# EAGLE design MSSRP-Temperature_System_beta_2layer (EAGLE 6.6.0)
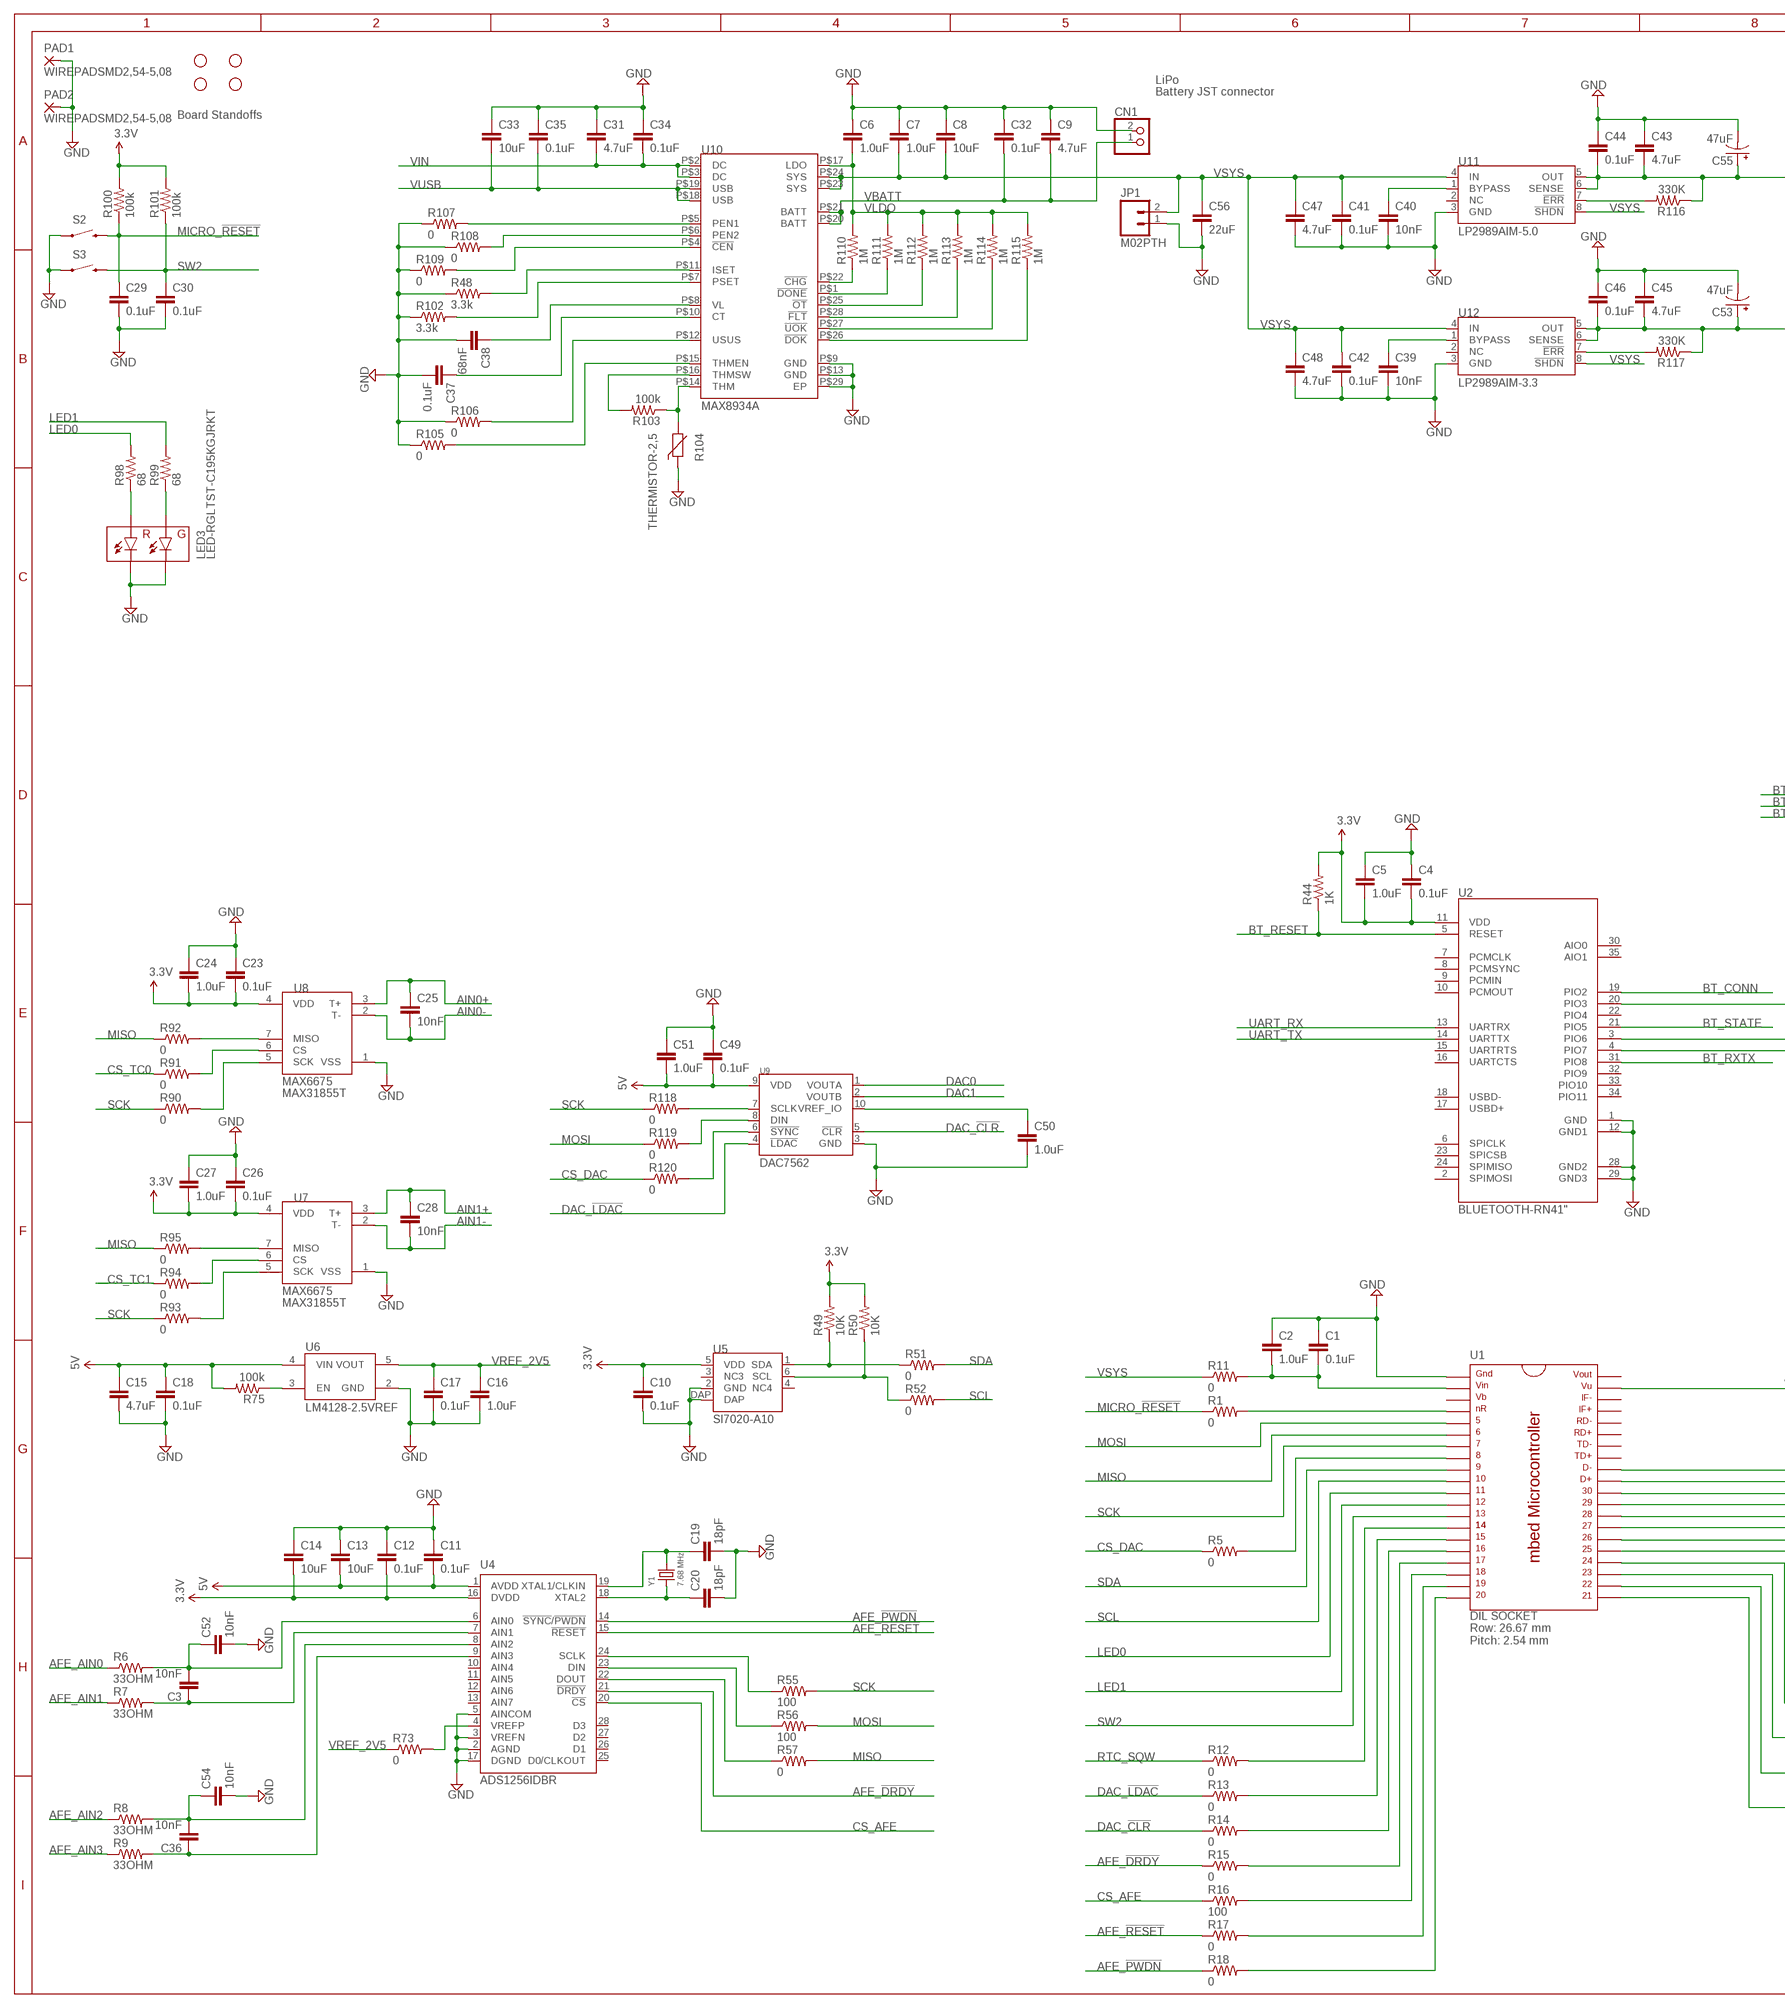
[diagram p0: schematic, sheet 1, part 1 of 2]
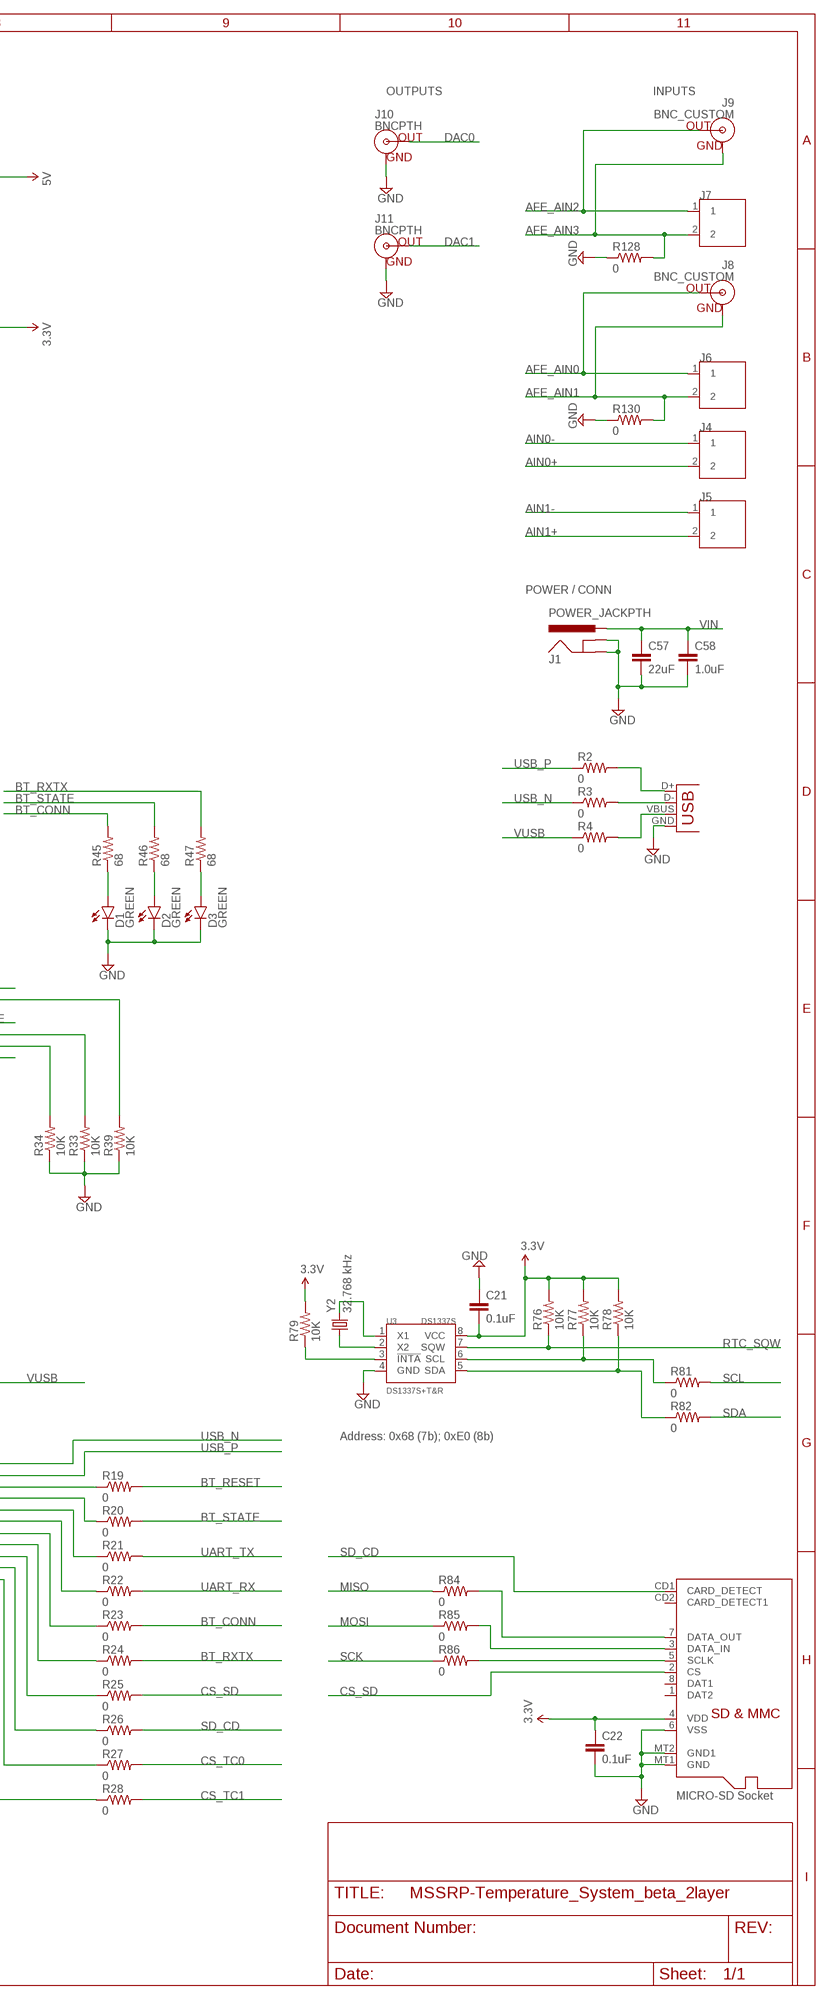
[diagram p1: schematic, sheet 1, part 2 of 2]

## Parts
C1  0.1uF  0.1UF-25V-5%(0603)  [0603-CAP]
C2  1.0uF  1.0UF-16V-10%(0603)  [0603-CAP]
C3  10nF  10NF/10000PF-50V-10%(0603)  [0603-CAP]
C4  0.1uF  0.1UF-25V-5%(0603)  [0603-CAP]
C5  1.0uF  1.0UF-16V-10%(0603)  [0603-CAP]
C6  1.0uF  1.0UF-16V-10%(0603)  [0603-CAP]
C7  1.0uF  1.0UF-16V-10%(0603)  [0603-CAP]
C8  10uF  10UF-6.3V-20%(0603)  [0603-CAP]
C9  4.7uF  4.7UF-6.3V-10%(0603)0603  [0603-CAP]
C10  0.1uF  0.1UF-25V-5%(0603)  [0603-CAP]
C11  0.1uF  0.1UF-25V-5%(0603)  [0603-CAP]
C12  0.1uF  0.1UF-25V-5%(0603)  [0603-CAP]
C13  10uF  10UF-6.3V-20%(0603)  [0603-CAP]
C14  10uF  10UF-6.3V-20%(0603)  [0603-CAP]
C15  4.7uF  4.7UF-6.3V-10%(0603)0603  [0603-CAP]
C16  1.0uF  1.0UF-16V-10%(0603)  [0603-CAP]
C17  0.1uF  0.1UF-25V-5%(0603)  [0603-CAP]
C18  0.1uF  0.1UF-25V-5%(0603)  [0603-CAP]
C19  18pF  18PF-50V-5%(0603)  [0603-CAP]
C20  18pF  18PF-50V-5%(0603)  [0603-CAP]
C21  0.1uF  0.1UF-25V-5%(0603)  [0603-CAP]
C22  0.1uF  0.1UF-25V-5%(0603)  [0603-CAP]
C23  0.1uF  0.1UF-25V-5%(0603)  [0603-CAP]
C24  1.0uF  1.0UF-16V-10%(0603)  [0603-CAP]
C25  10nF  10NF/10000PF-50V-10%(0603)  [0603-CAP]
C26  0.1uF  0.1UF-25V-5%(0603)  [0603-CAP]
C27  1.0uF  1.0UF-16V-10%(0603)  [0603-CAP]
C28  10nF  10NF/10000PF-50V-10%(0603)  [0603-CAP]
C29  0.1uF  0.1UF-25V-5%(0603)  [0603-CAP]
C30  0.1uF  0.1UF-25V-5%(0603)  [0603-CAP]
C31  4.7uF  4.7UF-6.3V-10%(0603)0603  [0603-CAP]
C32  0.1uF  0.1UF-25V-5%(0603)  [0603-CAP]
C33  10uF  10UF-6.3V-20%(0603)  [0603-CAP]
C34  0.1uF  0.1UF-25V-5%(0603)  [0603-CAP]
C35  0.1uF  0.1UF-25V-5%(0603)  [0603-CAP]
C36  10nF  10NF/10000PF-50V-10%(0603)  [0603-CAP]
C37  0.1uF  0.1UF-25V-5%(0603)  [0603-CAP]
C38  68nF  0.1UF-25V-5%(0603)  [0603-CAP]
C39  10nF  10NF/10000PF-50V-10%(0603)  [0603-CAP]
C40  10nF  10NF/10000PF-50V-10%(0603)  [0603-CAP]
C41  0.1uF  0.1UF-25V-5%(0603)  [0603-CAP]
C42  0.1uF  0.1UF-25V-5%(0603)  [0603-CAP]
C43  4.7uF  4.7UF-6.3V-10%(0603)0603  [0603-CAP]
C44  0.1uF  0.1UF-25V-5%(0603)  [0603-CAP]
C45  4.7uF  4.7UF-6.3V-10%(0603)0603  [0603-CAP]
C46  0.1uF  0.1UF-25V-5%(0603)  [0603-CAP]
C47  4.7uF  4.7UF-6.3V-10%(0603)0603  [0603-CAP]
C48  4.7uF  4.7UF-6.3V-10%(0603)0603  [0603-CAP]
C49  0.1uF  0.1UF-25V-5%(0603)  [0603-CAP]
C50  1.0uF  1.0UF-16V-10%(0603)  [0603-CAP]
C51  1.0uF  1.0UF-16V-10%(0603)  [0603-CAP]
C52  10nF  10NF/10000PF-50V-10%(0603)  [0603-CAP]
C53  47uF  47UF-10V-10%(TANT)  [EIA3528]
C54  10nF  10NF/10000PF-50V-10%(0603)  [0603-CAP]
C55  47uF  47UF-10V-10%(TANT)  [EIA3528]
C56  22uF  22UF-6.3V-20%(0805)  [0805]
C57  22uF  22UF-16V-20%-(1210)  [1210]
C58  1.0uF  1.0UF-16V-10%(0603)  [0603-CAP]
CN1  JST_2PIN-THM-RA  [JST-PH-2-THM-RA]
D1  GREEN  LED-GREEN0603  [LED-0603]
D2  GREEN  LED-GREEN0603  [LED-0603]
D3  GREEN  LED-GREEN0603  [LED-0603]
J1  POWER_JACKPTH  [POWER_JACK_PTH]
J2  USBSMD  [USB-MINIB]
J4  TE-2-TERMBLOCK  [TE-2-TERMBLOCK]
J5  TE-2-TERMBLOCK  [TE-2-TERMBLOCK]
J6  TE-2-TERMBLOCK  [TE-2-TERMBLOCK]
J7  TE-2-TERMBLOCK  [TE-2-TERMBLOCK]
J8  BNC_CUSTOM  [BNC_CUSTOM]
J9  BNC_CUSTOM  [BNC_CUSTOM]
J10  BNCPTH  [BNC]
J11  BNCPTH  [BNC]
JP1  M02PTH  [1X02]
LED3  LED-RGLTST-C195KGJRKT  [LTST-C195KGJRKT]
PAD1  WIREPADSMD2,54-5,08  [SMD2,54-5,08]
PAD2  WIREPADSMD2,54-5,08  [SMD2,54-5,08]
R1  0  0OHM1/10W5%(0603)  [0603]
R2  0  0OHM1/10W5%(0603)  [0603]
R3  0  0OHM1/10W5%(0603)  [0603]
R4  0  0OHM1/10W5%(0603)  [0603]
R5  0  0OHM1/10W5%(0603)  [0603]
R6  33OHM  33OHM1/10W1%(0603)  [0603]
R7  33OHM  33OHM1/10W1%(0603)  [0603]
R8  33OHM  33OHM1/10W1%(0603)  [0603]
R9  33OHM  33OHM1/10W1%(0603)  [0603]
R11  0  0OHM1/10W5%(0603)  [0603]
R12  0  0OHM1/10W5%(0603)  [0603]
R13  0  0OHM1/10W5%(0603)  [0603]
R14  0  0OHM1/10W5%(0603)  [0603]
R15  0  0OHM1/10W5%(0603)  [0603]
R16  100  100OHM1/10W1%(0603)  [0603-RES]
R17  0  0OHM1/10W5%(0603)  [0603]
R18  0  0OHM1/10W5%(0603)  [0603]
R19  0  0OHM1/10W5%(0603)  [0603]
R20  0  0OHM1/10W5%(0603)  [0603]
R21  0  0OHM1/10W5%(0603)  [0603]
R22  0  0OHM1/10W5%(0603)  [0603]
R23  0  0OHM1/10W5%(0603)  [0603]
R24  0  0OHM1/10W5%(0603)  [0603]
R25  0  0OHM1/10W5%(0603)  [0603]
R26  0  0OHM1/10W5%(0603)  [0603]
R27  0  0OHM1/10W5%(0603)  [0603]
R28  0  0OHM1/10W5%(0603)  [0603]
R33  10K  10KOHM1/10W1%(0603)0603  [0603-RES]
R34  10K  10KOHM1/10W1%(0603)0603  [0603-RES]
R39  10K  10KOHM1/10W1%(0603)0603  [0603-RES]
R44  1K  1KOHM1/10W1%(0603)  [0603-RES]
R45  68  390OHM1/10W1%(0603)  [0603-RES]
R46  68  390OHM1/10W1%(0603)  [0603-RES]
R47  68  390OHM1/10W1%(0603)  [0603-RES]
R48  3.3k  3.3MOHM-1/10W-1%(0603)  [0603-RES]
R49  10K  10KOHM1/10W1%(0603)0603  [0603-RES]
R50  10K  10KOHM1/10W1%(0603)0603  [0603-RES]
R51  0  0OHM1/10W5%(0603)  [0603]
R52  0  0OHM1/10W5%(0603)  [0603]
R55  100  100OHM1/10W1%(0603)  [0603-RES]
R56  100  100OHM1/10W1%(0603)  [0603-RES]
R57  0  0OHM1/10W5%(0603)  [0603]
R73  0  0OHM1/10W5%(0603)  [0603]
R75  100k  100KOHM1/10W1%(0603)  [0603-RES]
R76  10K  10KOHM1/10W1%(0603)0603  [0603-RES]
R77  10K  10KOHM1/10W1%(0603)0603  [0603-RES]
R78  10K  10KOHM1/10W1%(0603)0603  [0603-RES]
R79  10K  10KOHM1/10W1%(0603)0603  [0603-RES]
R81  0  0OHM1/10W5%(0603)  [0603]
R82  0  0OHM1/10W5%(0603)  [0603]
R84  0  0OHM1/10W5%(0603)  [0603]
R85  0  0OHM1/10W5%(0603)  [0603]
R86  0  0OHM1/10W5%(0603)  [0603]
R90  0  0OHM1/10W5%(0603)  [0603]
R91  0  0OHM1/10W5%(0603)  [0603]
R92  0  0OHM1/10W5%(0603)  [0603]
R93  0  0OHM1/10W5%(0603)  [0603]
R94  0  0OHM1/10W5%(0603)  [0603]
R95  0  0OHM1/10W5%(0603)  [0603]
R98  68  470OHM1/10W1%(0603)  [0603-RES]
R99  68  470OHM1/10W1%(0603)  [0603-RES]
R100  100k  100KOHM1/10W1%(0603)  [0603-RES]
R101  100k  100KOHM1/10W1%(0603)  [0603-RES]
R102  3.3k  3.3MOHM-1/10W-1%(0603)  [0603-RES]
R103  100k  100OHM1/10W1%(0603)  [0603-RES]
R104  THERMISTOR-2,5  [RS-2,5]
R105  0  0OHM1/10W5%(0603)  [0603]
R106  0  0OHM1/10W5%(0603)  [0603]
R107  0  0OHM1/10W5%(0603)  [0603]
R108  0  0OHM1/10W5%(0603)  [0603]
R109  0  0OHM1/10W5%(0603)  [0603]
R110  1M  330KOHM1/10W1%(0603)0603  [0603-RES]
R111  1M  330KOHM1/10W1%(0603)0603  [0603-RES]
R112  1M  330KOHM1/10W1%(0603)0603  [0603-RES]
R113  1M  330KOHM1/10W1%(0603)0603  [0603-RES]
R114  1M  330KOHM1/10W1%(0603)0603  [0603-RES]
R115  1M  330KOHM1/10W1%(0603)0603  [0603-RES]
R116  330K  330KOHM1/10W1%(0603)0603  [0603-RES]
R117  330K  330KOHM1/10W1%(0603)0603  [0603-RES]
R118  0  0OHM1/10W5%(0603)  [0603]
R119  0  0OHM1/10W5%(0603)  [0603]
R120  0  0OHM1/10W5%(0603)  [0603]
R128  0  0OHM1/10W5%(0603)  [0603]
R130  0  0OHM1/10W5%(0603)  [0603]
S2  SWITCH-MOMENTARY-2-SMD-1101NE  [TACTILE-SWITCH-1101NE]
S3  SWITCH-MOMENTARY-2-SMD-1101NE  [TACTILE-SWITCH-1101NE]
STANDOFF1  STAND-OFF  [STAND-OFF]
STANDOFF2  STAND-OFF  [STAND-OFF]
STANDOFF3  STAND-OFF  [STAND-OFF]
STANDOFF4  STAND-OFF  [STAND-OFF]
U1  MBED  [DIL40_0.9]
U2  BLUETOOTH-RN41"  [RN41]
U3  DS1337S+T&R  [SOIC8]
U4  ADS1256IDBR  [SSOP28]
U5  SI7020-A10  [DFN6]
U6  LM4128-2.5VREF  [SOT23-5]
U7  MAX6675  [SO08-MAX6675]
U8  MAX6675  [SO08-MAX6675]
U9  DAC7562  [MSOP10]
U10  MAX8934A  [QFN28]
U11  LP2989AIM  [SOIC8]
U12  LP2989AIM  [SOIC8]
U$1  MICROSD  [MICROSD]
Y1  7.68 MHz  CRYSTALSMD  [HC49UP]
Y2  32.768 kHz  CRYSTALSMD  [HC49UP]

## Nets
3.3V: C4.2 C5.2 C10.1 C12.2 C14.2 C21.2 C22.1 C23.2 C24.2 C26.2 C27.2 C45.2 C46.2 C53.A(+) R44.2 R49.2 R50.2 R76.2 R77.2 R78.2 R79.2 R100.2 R101.2 R117.1 U2.11(VDD) U3.8(VCC) U4.16(DVDD) U5.5(VDD) U7.4(VDD) U8.4(VDD) U12.5(OUT) U12.6(SENSE) U$1.4(VDD)
5V: C11.2 C13.2 C15.1 C18.1 C43.2 C44.2 C49.2 C51.2 C55.A(+) R75.2 R116.1 U4.1(AVDD) U6.4(VIN) U9.9(VDD) U11.5(OUT) U11.6(SENSE)
AFE_!DRDY: R15.1 U4.21(!DRDY)
AFE_!PWDN: R18.1 U4.14(!SYNC!/!PWDN)
AFE_!RESET: R17.1 U4.15(!RESET)
AFE_AIN0: J6.1 J8.S(OUT) R6.1
AFE_AIN1: J6.2 J8.GND R7.1 R130.2
AFE_AIN2: J7.1 J9.S(OUT) R8.1
AFE_AIN3: J7.2 J9.GND R9.1 R128.2
AIN0+: C25.1 J4.2 U8.3(T+)
AIN0-: C25.2 J4.1 U8.2(T-)
AIN1+: C28.1 J5.2 U7.3(T+)
AIN1-: C28.2 J5.1 U7.2(T-)
BT_CONN: R23.2 R45.2 U2.19(PIO2)
BT_RESET: R19.2 R44.1 U2.5(RESET)
BT_RXTX: R24.2 R47.2 U2.31(PIO8)
BT_STATE: R20.2 R46.2 U2.21(PIO5)
CS_AFE: R16.1 U4.20(!CS)
CS_DAC: R5.1 R120.1
CS_SD: R25.2 U$1.2(CS)
CS_TC0: R27.2 R91.1
CS_TC1: R28.2 R94.1
DAC0: J10.S(OUT) U9.1(VOUTA)
DAC1: J11.S(OUT) U9.2(VOUTB)
DAC_!CLR: R14.1 U9.5(!CLR)
DAC_!LDAC: R13.1 U9.4(!LDAC)
GND: C1.1 C2.1 C4.1 C5.1 C6.1 C7.1 C8.1 C9.1 C10.2 C11.1 C12.1 C13.1 C14.1 C15.2 C16.2 C17.2 C18.2 C19.2 C20.2 C21.1 C22.2 C23.1 C24.1 C26.1 C27.1 C29.2 C30.2 C31.1 C32.1 C33.1 C34.1 C35.1 C37.2 C38.2 C39.2 C40.2 C41.2 C42.2 C43.1 C44.1 C45.1 C46.1 C47.2 C48.2 C49.1 C50.2 C51.1 C52.2 C53.C(-) C54.2 C55.C(-) C56.2 C57.2 C58.2 CN1.2 D1.C D2.C D3.C J1.GND J1.GNDBREAK J2.GND J10.GND J11.GND JP1.1 LED3.P$3(GC) LED3.P$4(RC) PAD1.1(P) PAD2.1(P) R33.1 R34.1 R39.1 R48.1 R102.1 R104.1 R105.1 R106.1 R107.1 R108.1 R109.1 R128.1 R130.1 S2.P$1 S3.P$1 U1.1 U2.1(GND) U2.12(GND1) U2.28(GND2) U2.29(GND3) U3.4(GND) U4.2(AGND) U4.3(VREFN) U4.5(AINCOM) U4.17(DGND) U5.2(GND) U5.DAP U6.2(GND) U7.1(VSS) U8.1(VSS) U9.3(GND) U10.P$9(GND) U10.P$13(GND) U10.P$29(EP) U11.3(GND) U12.3(GND) U$1.6(VSS) U$1.MT1(GND) U$1.MT2(GND1)
LED0: R98.2 U1.11
LED1: R99.2 U1.12
MICRO_!RESET: C29.1 R1.1 R100.1 S2.P$2
MISO: R57.2 R84.1 R92.1 R95.1 U1.6
MOSI: R56.2 R85.1 R119.1 U1.5
N$1: R1.2 U1.4
N$2: J2.D- R3.2
N$3: J2.D+ R2.2
N$4: J2.VBUS R4.2
N$5: R5.2 U1.8
N$7: C3.1 R7.2 U4.7(AIN1)
N$8: C1.2 C2.2 R11.2 U1.2
N$9: C3.2 C52.1 R6.2 U4.6(AIN0)
N$10: C36.2 C54.1 R8.2 U4.8(AIN2)
N$11: C36.1 R9.2 U4.9(AIN3)
N$12: R12.2 U1.14
N$13: R19.1 U1.30
N$14: R13.2 U1.15
N$15: R20.1 U1.29
N$16: R21.1 U1.28
N$17: R22.1 U1.27
N$18: R23.1 U1.26
N$19: R24.1 U1.25
N$20: R14.2 U1.16
N$21: R15.2 U1.17
N$22: R16.2 U1.18
N$23: R17.2 U1.19
N$24: R18.2 U1.20
N$25: R25.1 U1.24
N$26: R26.1 U1.23
N$27: R27.1 U1.22
N$28: R28.1 U1.21
N$33: R34.2 U2.4(PIO7)
N$34: R33.2 U2.3(PIO6)
N$39: R39.2 U2.20(PIO3)
N$44: D1.A R45.1
N$45: D2.A R46.1
N$46: D3.A R47.1
N$47: R49.1 R51.1 U5.1(SDA)
N$48: R50.1 R52.1 U5.6(SCL)
N$51: R55.1 U4.24(SCLK)
N$52: R56.1 U4.23(DIN)
N$53: R57.1 U4.22(DOUT)
N$69: R73.2 U4.4(VREFP)
N$71: R75.1 U6.3(EN)
N$72: C20.1 U4.18(XTAL2) Y1.1
N$73: C19.1 U4.19(XTAL1/CLKIN) Y1.2
N$74: U3.2(X2) Y2.1
N$75: U3.1(X1) Y2.2
N$77: R77.1 R81.1 U3.6(SCL)
N$78: R78.1 R82.1 U3.5(SDA)
N$81: R86.2 U$1.5(SCLK)
N$82: R85.2 U$1.3(DATA_IN)
N$83: R84.2 U$1.7(DATA_OUT)
N$86: R92.2 U8.7(MISO)
N$87: R91.2 U8.6(CS)
N$88: R90.2 U8.5(SCK)
N$89: R95.2 U7.7(MISO)
N$90: R94.2 U7.6(CS)
N$91: R93.2 U7.5(SCK)
N$92: LED3.P$2(RA) R98.1
N$93: LED3.P$1(GA) R99.1
N$97: R103.1 R104.2 U10.P$14(THM)
N$98: R103.2 U10.P$16(THMSW)
N$99: R105.2 U10.P$15(THMEN)
N$100: R106.2 U10.P$12(USUS)
N$101: R107.2 U10.P$5(PEN1)
N$102: R108.2 U10.P$6(PEN2)
N$103: R109.2 U10.P$4(!CEN)
N$104: R48.2 U10.P$11(ISET)
N$105: R102.2 U10.P$7(PSET)
N$106: C38.1 U10.P$8(VL)
N$107: C37.1 U10.P$10(CT)
N$109: R110.1 U10.P$22(!CHG)
N$110: R111.1 U10.P$1(!DONE)
N$111: R112.1 U10.P$25(!OT)
N$112: R113.1 U10.P$28(!FLT)
N$113: R114.1 U10.P$27(!UOK)
N$114: R115.1 U10.P$26(!DOK)
N$115: C40.1 U11.1(BYPASS)
N$116: C39.1 U12.1(BYPASS)
N$117: R116.2 U11.7(!ERR)
N$118: R117.2 U12.7(!ERR)
N$119: R118.2 U9.7(SCLK)
N$120: R119.2 U9.8(DIN)
N$121: R120.2 U9.6(!SYNC)
N$124: C50.1 U9.10(VREF_IO)
RTC_!INTA: R79.1 U3.3(!INTA)
RTC_SQW: R12.1 R76.1 U3.7(SQW)
SCK: R55.2 R86.1 R90.1 R93.1 R118.1 U1.7
SCL: R52.2 R81.2 U1.10
SD_CD: R26.2 U$1.CD1(CARD_DETECT)
SDA: R51.2 R82.2 U1.9
SW2: C30.1 R101.1 S3.P$2 U1.13
UART_RX: R22.2 U2.13(UARTRX)
UART_TX: R21.2 U2.14(UARTTX)
USB_N: R3.1 U1.32
USB_P: R2.1 U1.31
VBATT: C9.2 C32.2 CN1.1 U10.P$20(BATT) U10.P$21(BATT)
VIN: C31.2 C34.2 C57.1 C58.1 J1.PWR U10.P$2(DC) U10.P$3(DC)
VLDO: C6.2 R110.2 R111.2 R112.2 R113.2 R114.2 R115.2 U10.P$17(LDO)
VREF_2V5: C16.1 C17.1 R73.1 U6.5(VOUT)
VSYS: C7.2 C8.2 C41.1 C42.1 C47.1 C48.1 C56.1 JP1.2 R11.1 U10.P$23(SYS) U10.P$24(SYS) U11.4(IN) U11.8(!SHDN) U12.4(IN) U12.8(!SHDN)
VUSB: C33.2 C35.2 R4.1 U1.39 U10.P$18(USB) U10.P$19(USB)
Unconnected: U1.3 U1.33 U1.34 U1.35 U1.36 U1.37 U1.38 U1.40 U2.2(SPIMOSI) U2.6(SPICLK) U2.7(PCMCLK) U2.8(PCMSYNC) U2.9(PCMIN) U2.10(PCMOUT) U2.15(UARTRTS) U2.16(UARTCTS) U2.17(USBD+) U2.18(USBD-) U2.22(PIO4) U2.23(SPICSB) U2.24(SPIMISO) U2.30(AIO0) U2.32(PIO9) U2.33(PIO10) U2.34(PIO11) U2.35(AIO1) U4.10(AIN4) U4.11(AIN5) U4.12(AIN6) U4.13(AIN7) U4.25(D0/CLKOUT) U4.26(D1) U4.27(D2) U4.28(D3) U5.3(NC3) U5.4(NC4) U11.2(NC) U12.2(NC) U$1.1(DAT2) U$1.8(DAT1) U$1.CD2(CARD_DETECT1)

## Notes on the sheet
- LiPo
- Battery JST connector | OUTPUTS | INPUTS
- Board Standoffs
- U10
- LP2989AIM-5.0
- LP2989AIM-3.3
- MAX8934A
- POWER / CONN
- MAX31855T
- DAC7562
- MAX31855T
- Address: 0x68 (7b); 0xE0 (8b)
- DIL SOCKET
  Row: 26.67 mm
  Pitch: 2.54 mm
- MICRO-SD Socket

## Library data of the parts
C1 C4 C10-C12 C17 C18 C21-C23 C26 C29 C30 C32 C34 C35 C37 C41 C42 C44 C46 C49 = SparkFun-Capacitors:0.1UF-25V-5%(0603): CAP-08604; PROD_ID: CAP-08604
C2 C5-C7 C16 C24 C27 C50 C51 C58 = SparkFun-Capacitors:1.0UF-16V-10%(0603): CAP-00868; PROD_ID: CAP-00868
C3 C25 C28 C36 C39 C40 C52 C54 = SparkFun-Capacitors:10NF/10000PF-50V-10%(0603): CAP-00867; PROD_ID: CAP-00867
C8 C13 C14 C33 = SparkFun-Capacitors:10UF-6.3V-20%(0603): CAP-11015; PROD_ID: CAP-11015
C9 C15 C31 C43 C45 C47 C48 = SparkFun-Capacitors:4.7UF-6.3V-10%(0603): CAP-08280; PROD_ID: CAP-08280
C19 C20 = SparkFun-Capacitors:18PF-50V-5%(0603): CAP-08267; PROD_ID: CAP-08267
C38 = SparkFun-Capacitors:0.1UF-25V-5%(0603): CAP-08604; PROD_ID: CAP-08604; VALUE: 0.1uF
C53 C55 = SparkFun-Capacitors:47UF-10V-10%(TANT): CAP-08310 47uF Tantalum SMT 10V 10% (EIA-3528); PROD_ID: CAP-08310
C56 = SparkFun-Capacitors:22UF-6.3V-20%(0805): CAP-08402 Ceramic; PROD_ID: CAP-08402
C57 = SparkFun-Capacitors:22UF-16V-20%-(1210): CAP-10381; PROD_ID: CAP-10381
CN1 = adafruit:JST_2PIN: JST 2-Pin Connectors of various flavors SMT-RA (S2B-PH-SM4) 4UConnector #17311 SMT (B2B-PH-SM4) THM-RA (S2B-PH) THM (B2B-PH)
D1-D3 = SparkFun-LED:LED-GREEN: Various green LEDs Green LEDs used in SFE Production 0603- DIO-00821 LARGE- DIO-00862 LILYPAD- DIO-09910; PROD_ID: DIO-00821
J1 = SparkFun-Connectors:POWER_JACK: Power Jack This is the standard 5.5mm barrel jack for power. The PTH is the most common, proven, reliable, footprint. The Slot footprint only works if the mill layer is transmitted to the PCB fab house so be warned. Mating wall wart : TOL-00298 (and others); PROD_ID: PRT-00119
J2 = SparkFun-Connectors:USB: USB Connectors USB-B-PTH is fully proven SKU : PRT-00139/CONN-08278 USB-miniB is fully proven SKU : PRT-00587 USB-A-PCB is untested. USB-A-H is throughly reviewed, but untested. Spark Fun Electronics SKU : PRT-00437 USB-B-SMT is throughly reviewed, but untested. Needs silkscreen touching up. USB-A-S has not been used/tested USB-MB-H has not been used/tested USB-MICROB has been used. CONN-09505; PROD_ID: CONN-08193
J4-J7 = MSSRP-Lib:TE-2-TERMBLOCK
J8 J9 = MSSRP-Lib:BNC_CUSTOM
J10 J11 = SparkFun-Connectors:BNC: BNC Connector, Mouser Part# 5227161
JP1 = SparkFun-Connectors:M02: Standard 2-pin 0.1" header. Use with - straight break away headers ( PRT-00116) - right angle break away headers (PRT-00553) - swiss pins (PRT-00743) - machine pins (PRT-00117) - female headers (PRT-00115) Molex polarized connector foot print use with: PRT-08233 with associated crimp pins and housings. 2.54_SCREWTERM for use with PRT-10571. 3.5mm Screw Terminal footprints for PRT-08084 5mm Screw Terminal footprints for use with PRT-08433
LED3 = SparkFun-LED:LED-RG; PROD_ID: DIO-12140
PAD1 PAD2 = wirepad:WIREPAD: Wire PAD connect wire on PCB
R1-R5 R11-R15 R17-R28 R51 R52 R57 R73 R81 R82 R84-R86 R90-R95 R105-R109 R118-R120 R128 R130 = SparkFun-Resistors:0OHM1/10W5%(0603): RES-08609; PROD_ID: RES-08609
R6-R9 = SparkFun-Resistors:33OHM1/10W1%(0603): RES-08270; PROD_ID: RES-08270
R16 R55 R56 = SparkFun-Resistors:100OHM1/10W1%(0603): RES-07863; PROD_ID: RES-07863
R33 R34 R39 R49 R50 R76-R79 = SparkFun-Resistors:10KOHM1/10W1%(0603): RES-00824; PROD_ID: RES-00824
R44 = SparkFun-Resistors:1KOHM1/10W1%(0603): RES-07856; PROD_ID: RES-07856
R45-R47 = SparkFun-Resistors:390OHM1/10W1%(0603): RES-07864; PROD_ID: RES-07864; VALUE: 390
R48 R102 = SparkFun-Resistors:3.3MOHM-1/10W-1%(0603): RES-11057; PROD_ID: RES-11057
R75 R100 R101 = SparkFun-Resistors:100KOHM1/10W1%(0603): RES-07828; PROD_ID: RES-07828
R98 R99 = SparkFun-Resistors:470OHM1/10W1%(0603): RES-07869; PROD_ID: RES-07869; VALUE: 470
R103 = SparkFun-Resistors:100OHM1/10W1%(0603): RES-07863; PROD_ID: RES-07863; VALUE: 100
R104 = varistor:THERMISTOR: THERMISTOR
R110-R115 = SparkFun-Resistors:330KOHM1/10W1%(0603): RES-08968; PROD_ID: RES-08968; VALUE: 330K
R116 R117 = SparkFun-Resistors:330KOHM1/10W1%(0603): RES-08968; PROD_ID: RES-08968
S2 S3 = SparkFun-Electromechanical:SWITCH-MOMENTARY-2: Various NO switches- pushbuttons, reed, etc
STANDOFF1-STANDOFF4 = SparkFun-Electromechanical:STAND-OFF: #4 Stand Off This is the mechanical footprint for a #4 phillips button head screw. Use the keepout ring to avoid running the screw head into surrounding components. SKU : PRT-00447
U1 = microbuilder:MBED: mbed Microcontroller, DIP40, 0.9"
U2 = SparkFun-RF:BLUETOOTH-RN41: Bluetooth SMD module
U3 = MSSRP-Lib:DS1337S+T&R
U4 = MSSRP-Lib:ADS1256
U5 = MSSRP-Lib:SI7020
U6 = SparkFun-PowerIC:LM4128-2.5VREF: .1% accurate low-current voltage reference
U7 U8 = SparkFun-AnalogIC:MAX6675: K-type thermocouple ADC, SPI output
U9 = MSSRP-Lib:DAC7562
U10 = MSSRP-Lib:MAX8934
U11 U12 = MSSRP-Lib:LP2989
U$1 = adafruit:MICROSD: Micro-SD / Transflash card holder with SPI pinout For the 3M # 2908-05WB-MG and/or 4UCON #19656 push-push type
Y1 = microbuilder:CRYSTAL: Crystals HC49UP - Surface Mount Crystal 4.0MHz 18pF +/-30ppm Surface Mount Crystal [Digikey: 535-9857-1-ND] 12.0 MHz Surface Mount Crystal [Digikey: 535-9869-6-ND] 25.0 MHz Surface Mount Crystal [Digikey: 535-9078-1-ND] 2.5 x 2.0mm - MEMs SMT Crystal 16.0 MHz 10pF 20ppm 2.5 x 2.0mm Crystal [Digikey -40-85°C: 535-10923-1-ND] 3.2 x 2.5mm - MEMs SMT Crystal 12.0 MHz 8pF 15ppm 3.2 x 2.5mm Crystal [Digikey: -10-70°C: 644-1047-1-ND -40-125°C: 644-1128-1-ND] 16.0 MHz 8pF 15ppm 3.2 x 2.5mm Crystal [Digikey: -10-70°C: 644-1049-1-ND -40-125°C: 644-1129-2-ND] 16.0 MHz 10pF 10ppm 3.2 x 2.5mm Crystal [Digikey: 644-1100-1-ND] 27.12 MHz 18pF 30ppm 3.2 x 2.5mm Crystal [Digikey: 887-1424-1-ND] 27.12MHz 10pF 10ppm 3.2 x 2.5mm Crystal [Digikey: 887-1329-1-ND] 4.9 x 1.8mm - MEMs SMT Crystal 32.768 KHz 12.5pF 20ppm 4.9 x 1.8mm Crystal [Digikey: SE2415CT-ND] 8.0 x 3.8mm - Surface Mount Crystal 32.768kHz 12.5pF 20ppm -40°C-85°C [Digikey: 535-9166-2-ND] Cylinder 32.768KHz Cylinder Crystal (2x6mm body) [Ex. Digikey: 300-8341-2-ND]
Y2 = SparkFun-FreqCtrl:CRYSTAL: Various standard crystals. Proven footprints. Spark Fun Electronics SKU : COM-00534

## Net classes
0 default: width 0.203 mm, clearance 0.203 mm

## Board
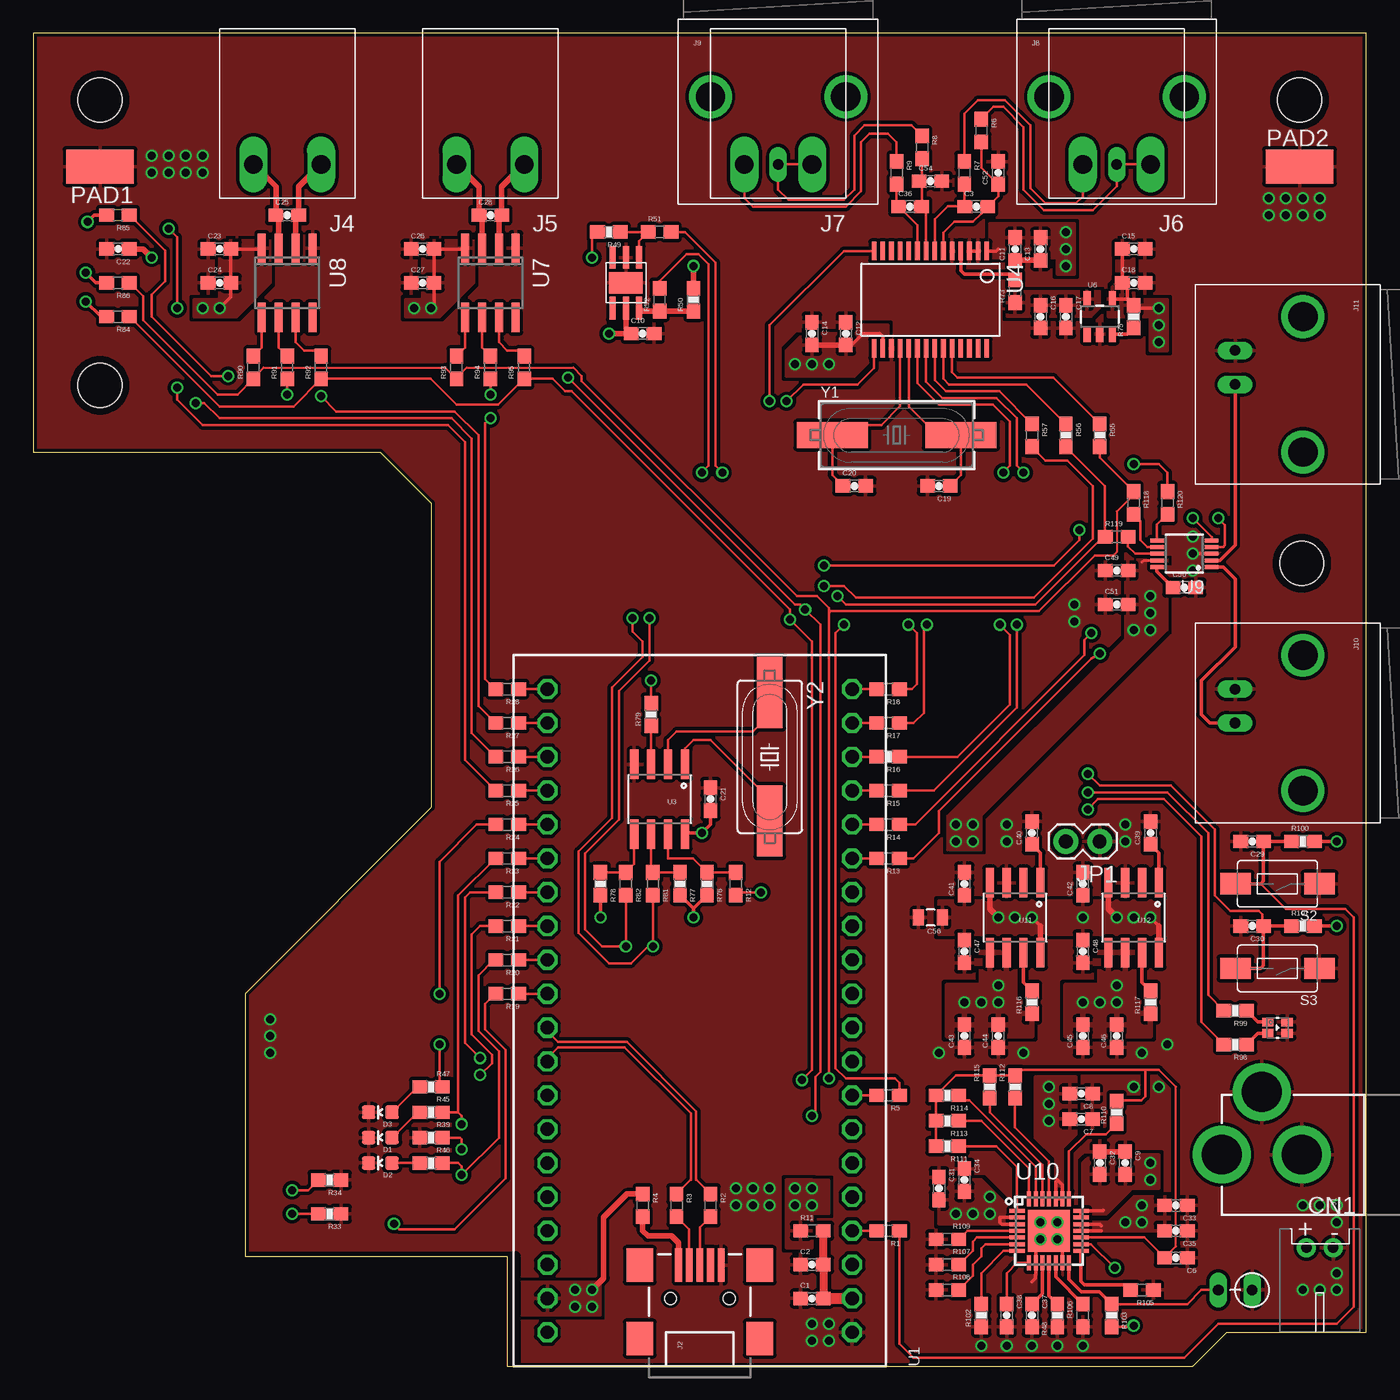
[diagram p2: board, top side]
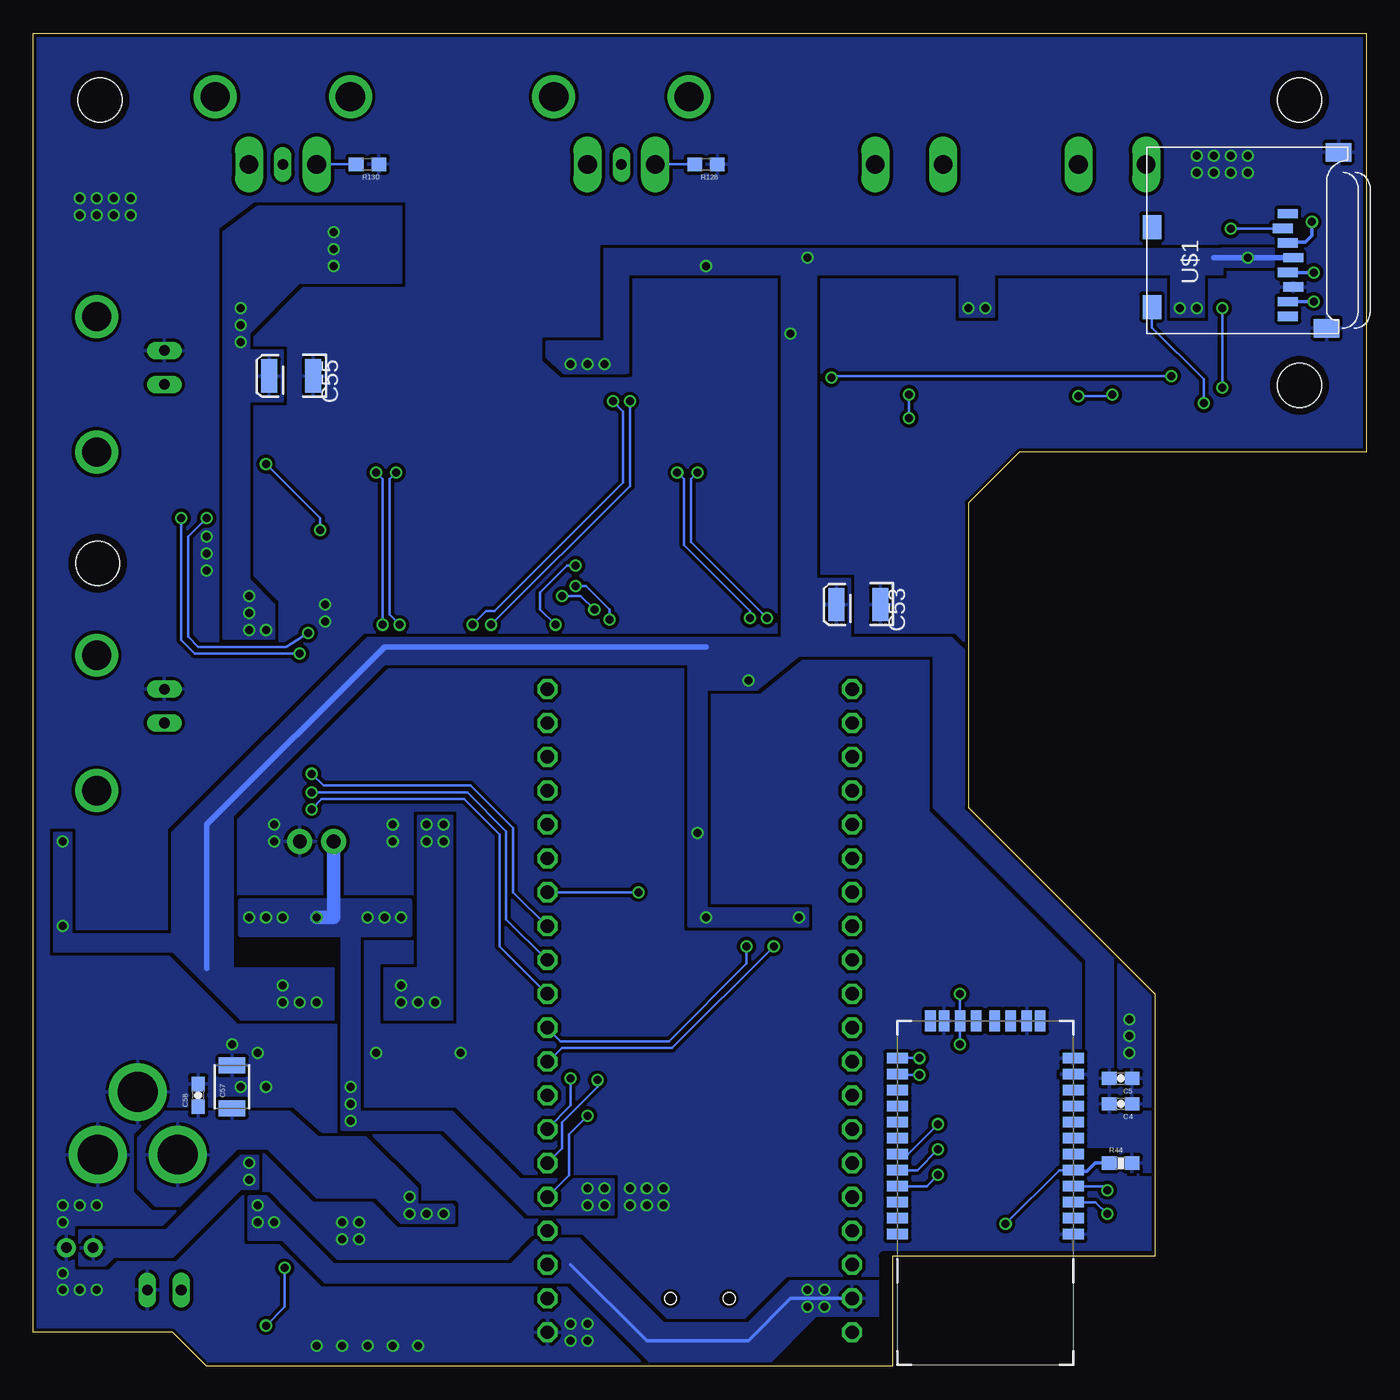
[diagram p3: board, bottom side, seen from below]

Size 100 x 100 mm. Coordinates in mm from the lower left corner, seen from the top.
Outline: 35.56,0 87,0 89.53,2.54 100,2.54 100,100 0,100 0,68.58 26.04,68.58 29.84,64.77 29.84,41.91 15.88,27.94 15.88,8.26 35.56,8.26 35.56,0
Copper layers (1*16): Top 0.035mm / dielectric 1.5mm / Bottom 0.035mm
Design rules "dirt_cheap_dirty_boards.v1": minimum track width 5mil, minimum drill 12mil, track to track 5mil, track to pad 5mil, pad to pad 5mil, via to via 5mil, smd to smd 0mil, copper to edge 10mil, drill to drill 10mil, minimum pad ring 10mil, minimum via ring 6mil, stop-mask expansion 2mil, vias tented up to drill 25mil, thermal gap 10mil
tRestrict: area 15.9,0 to 36.2,8.3
bRestrict: area 15.9,0 to 36.2,8.3

### Footprints (pad centres in the part's own frame; a part is rotated, then mirrored left to right if it is on the bottom)
0603-CAP = smd 1.1 x 1: 1 -0.85,0; 2 0.85,0
EIA3528 = smd 1.2 x 2.5: A 1.65,0; C -1.65,0
0805 = smd 0.8 x 1.2: 1 -0.9,0; 2 0.9,0
1210 = smd 1.2 x 2: 1 -1.6,0; 2 1.6,0
JST-PH-2-THM-RA = drill 0.8 pad 1.422: 1 1,0; 2 -1,0
LED-0603 = smd 1 x 1: A 0,-0.877; C 0,0.877
POWER_JACK_PTH = drill 2.997 pad 4.318: GND 0,7.7; GNDBREAK 4.7,10.7; PWR 0,13.7
USB-MINIB = smd 2.5 x 0.5: D+ 2.5,0; D- 2.5,0.8; GND 2.5,-1.6; ID 2.5,-0.8; VBUS 2.5,1.6 | smd 2.5 x 2: MTN1 -3,4.5; MTN2 2.5,4.5; MTN3 -3,-4.5; MTN4 2.5,-4.5 | hole 0.9: 0,2.2; 0,-2.2
TE-2-TERMBLOCK = drill 1.4 long: 1 -2.54,0; 2 2.54,0
BNC_CUSTOM = drill 2.2: 3 -5.08,5.08; 4 5.08,5.08 | drill 1.4 long: GND -2.54,0 | drill 0.8 long: S 0,0
BNC = drill 2.2: 3 -5.08,5.08; 4 5.08,5.08 | drill 0.8 long: GND -2.54,0; S 0,0
1X02 = drill 1.016 pad 1.88: 1 0,0; 2 2.54,0
LTST-C195KGJRKT = smd 0.65 x 0.85: P$1 0.425,0.725; P$2 -0.425,0.725; P$3 0.425,-0.725; P$4 -0.425,-0.725
SMD2,54-5,08 = smd 2.54 x 5.08: 1 0,0
0603 = smd 1.1 x 1: 1 -0.85,0; 2 0.85,0
0603-RES = smd 1.1 x 1: 1 -0.85,0; 2 0.85,0
RS-2,5 = drill 0.813 long: 1 -1.27,0; 2 1.27,0
TACTILE-SWITCH-1101NE = smd 2.3 x 1.6: P$1 -3.15,0; P$2 3.15,0
STAND-OFF = hole 3.302: 0,0
DIL40_0.9 = drill 1 pad 1.397 octagon: 1 -22.86,-11.43; 2 -20.32,-11.43; 3 -17.78,-11.43; 4 -15.24,-11.43; 5 -12.7,-11.43; 6 -10.16,-11.43; 7 -7.62,-11.43; 8 -5.08,-11.43; 9 -2.54,-11.43; 10 0,-11.43; 11 2.54,-11.43; 12 5.08,-11.43; 13 7.62,-11.43; 14 10.16,-11.43; 15 12.7,-11.43; 16 15.24,-11.43; 17 17.78,-11.43; 18 20.32,-11.43; 19 22.86,-11.43; 20 25.4,-11.43; 21 25.4,11.43; 22 22.86,11.43; 23 20.32,11.43; 24 17.78,11.43; 25 15.24,11.43; 26 12.7,11.43; 27 10.16,11.43; 28 7.62,11.43; 29 5.08,11.43; 30 2.54,11.43; 31 0,11.43; 32 -2.54,11.43; 33 -5.08,11.43; 34 -7.62,11.43; 35 -10.16,11.43; 36 -12.7,11.43; 37 -15.24,11.43; 38 -17.78,11.43; 39 -20.32,11.43; 40 -22.86,11.43
RN41 = smd 0.8 x 1.6: 1 -6.6,-6.6; 2 -5.4,-6.6; 3 -4.2,-6.6; 4 -3,-6.6; 5 -1.8,-6.6; 6 -0.6,-6.6; 7 0.6,-6.6; 8 1.8,-6.6; 9 3,-6.6; 10 4.2,-6.6; 11 5.4,-6.6; 12 6.6,-6.6; 13 6.6,6.6; 14 5.4,6.6; 15 4.2,6.6; 16 3,6.6; 17 1.8,6.6; 18 0.6,6.6; 19 -0.6,6.6; 20 -1.8,6.6; 21 -3,6.6; 22 -4.2,6.6; 23 -5.4,6.6; 24 -6.6,6.6 | smd 1.6 x 0.8: 28 9.4,3.1; 29 9.4,-3.1; 30 9.4,4.122; 31 9.4,1.9; 32 9.4,0.7; 33 9.4,-0.7; 34 9.4,-1.9; 35 9.4,-4.122
SOIC8 = smd 0.61 x 2.21: 1 -1.905,-2.616; 2 -0.635,-2.616; 3 0.635,-2.616; 4 1.905,-2.616; 5 1.905,2.616; 6 0.635,2.616; 7 -0.635,2.616; 8 -1.905,2.616
SSOP28 = smd 0.348 x 1.397: 1 -4.225,-3.656; 2 -3.575,-3.656; 3 -2.925,-3.656; 4 -2.275,-3.656; 5 -1.625,-3.656; 6 -0.975,-3.656; 7 -0.325,-3.656; 8 0.325,-3.656; 9 0.975,-3.656; 10 1.625,-3.656; 11 2.275,-3.656; 12 2.925,-3.656; 13 3.575,-3.656; 14 4.225,-3.656; 15 4.225,3.656; 16 3.575,3.656; 17 2.925,3.656; 18 2.275,3.656; 19 1.625,3.656; 20 0.975,3.656; 21 0.325,3.656; 22 -0.325,3.656; 23 -0.975,3.656; 24 -1.625,3.656; 25 -2.275,3.656; 26 -2.925,3.656; 27 -3.575,3.656; 28 -4.225,3.656
DFN6 = smd 1.7 x 0.45: 1 -1.9,1; 2 -1.9,0; 3 -1.9,-1; 4 1.9,-1; 5 1.9,0; 6 1.9,1 | smd 1.6 x 2.5: DAP 0,0
SOT23-5 = smd 0.55 x 1.2: 1 -0.95,-1.3; 2 0,-1.3; 3 0.95,-1.3; 4 0.95,1.3; 5 -0.95,1.3
SO08-MAX6675 = smd 0.6 x 2.2: 1 -1.905,-2.6; 2 -0.635,-2.6; 3 0.635,-2.6; 4 1.905,-2.6; 5 1.905,2.6; 6 0.635,2.6; 7 -0.635,2.6; 8 -1.905,2.6
MSOP10 = smd 0.3 x 1: 1 -1,-2.05; 2 -0.5,-2.05; 3 0,-2.05; 4 0.5,-2.05; 5 1,-2.05; 6 1,2.05; 7 0.5,2.05; 8 0,2.05; 9 -0.5,2.05; 10 -1,2.05
QFN28 = smd 1.15 x 0.3: P$1 -2.4,1.5; P$2 -2.4,1; P$3 -2.4,0.5; P$4 -2.4,0; P$5 -2.4,-0.5; P$6 -2.4,-1; P$7 -2.4,-1.5; P$15 2.4,-1.5; P$16 2.4,-1; P$17 2.4,-0.5; P$18 2.4,0; P$19 2.4,0.5; P$20 2.4,1; P$21 2.4,1.5 | smd 0.3 x 1.15: P$8 -1.5,-2.4; P$9 -1,-2.4; P$10 -0.5,-2.4; P$11 0,-2.4; P$12 0.5,-2.4; P$13 1,-2.4; P$14 1.5,-2.4; P$22 1.5,2.4; P$23 1,2.4; P$24 0.5,2.4; P$25 0,2.4; P$26 -0.5,2.4; P$27 -1,2.4; P$28 -1.5,2.4 | smd 3.15 x 3.15: P$29 0,0
MICROSD = smd 0.7 x 1.5: 1 9,-10.64; 2 7.9,-10.24; 3 6.8,-10.64; 4 5.7,-11.04; 5 4.6,-10.64; 6 3.5,-11.04; 7 2.4,-10.64; 8 1.3,-10.64 | smd 1.8 x 1.4: CD1 2,-0.44; CD2 8,-0.44 | smd 1.4 x 1.9: MT1 0.4,-13.54; MT2 13.6,-14.44
HC49UP = smd 5.334 x 1.93: 1 -4.826,0; 2 4.826,0

### Placement (x,y rotation side)
C1  58.42,5.08 0 top
C2  58.42,7.62 0 top
C3  70.74,87 0 top
C4  18.41,19.68 180 bottom
C5  18.41,21.59 180 bottom
C6  85.72,8.13 180 top
C7  78.61,18.54 180 top
C8  78.61,20.45 180 top
C9  81.92,15.24 270 top
C10  45.72,77.47 0 top
C11  73.66,83.82 90 top
C12  60.96,77.47 270 top
C13  75.56,83.82 90 top
C14  58.42,77.47 270 top
C15  82.55,83.82 0 top
C16  75.56,78.74 270 top
C17  77.47,78.74 270 top
C18  82.55,81.28 0 top
C19  67.94,66.04 180 top
C20  61.59,66.04 0 top
C21  50.8,42.55 270 top
C22  6.35,83.82 180 top
C23  13.97,83.82 0 top
C24  13.97,81.28 0 top
C25  19.05,86.36 0 top
C26  29.21,83.82 0 top
C27  29.21,81.28 0 top
C28  34.29,86.36 0 top
C29  91.44,39.37 180 top
C30  91.44,33.02 180 top
C31  67.94,13.34 270 top
C32  80.01,15.24 270 top
C33  85.72,12.06 180 top
C34  69.85,13.97 270 top
C35  85.72,10.16 180 top
C36  65.79,87 0 top
C37  74.93,3.81 270 top
C38  73.03,3.81 270 top
C39  83.82,40.01 90 top
C40  74.93,40.01 90 top
C41  69.85,36.2 90 top
C42  78.74,36.2 90 top
C43  69.85,24.77 90 top
C44  72.39,24.77 90 top
C45  78.74,24.77 90 top
C46  81.28,24.77 90 top
C47  69.85,31.11 270 top
C48  78.74,31.11 270 top
C49  81.28,59.69 0 top
C50  86.36,58.42 0 top
C51  81.28,57.15 0 top
C52  72.39,89.53 90 top
C53  38.1,57.15 180 bottom
C54  67.31,88.9 0 top
C55  80.64,74.3 180 bottom
C56  67.31,33.66 180 top
C57  85.09,20.95 90 bottom
C58  87.63,20.32 90 bottom
CN1  96.52,8.89 180 top
D1  26.04,17.14 90 top
D2  26.04,15.24 90 top
D3  26.04,19.05 90 top
J1  102.87,15.88 90 top
J2  50,5.08 90 top
J4  19.05,90.17 180 top
J5  34.29,90.17 180 top
J6  81.28,90.17 180 top
J7  55.88,90.17 180 top
J8  81.28,90.17 0 top
J9  55.88,90.17 0 top
J10  90.17,48.26 270 top
J11  90.17,73.66 270 top
JP1  80.01,39.37 180 top
LED3  93.34,25.4 90 top
PAD1  5,90 90 top
PAD2  95,90 270 top
R1  64.14,10.16 180 top
R2  50.8,12.06 270 top
R3  48.26,12.06 270 top
R4  45.72,12.06 270 top
R5  64.14,20.32 180 top
R6  71.12,92.71 270 top
R7  69.85,89.53 270 top
R8  66.67,91.44 270 top
R9  64.77,89.53 270 top
R11  58.42,10.16 0 top
R12  52.7,36.2 270 top
R13  64.14,38.1 180 top
R14  64.14,40.64 180 top
R15  64.14,43.18 180 top
R16  64.14,45.72 180 top
R17  64.14,48.26 180 top
R18  64.14,50.8 180 top
R19  35.56,27.94 180 top
R20  35.56,30.48 180 top
R21  35.56,33.02 180 top
R22  35.56,35.56 180 top
R23  35.56,38.1 180 top
R24  35.56,40.64 180 top
R25  35.56,43.18 180 top
R26  35.56,45.72 180 top
R27  35.56,48.26 180 top
R28  35.56,50.8 180 top
R33  22.23,11.43 180 top
R34  22.23,13.97 180 top
R39  29.84,17.14 0 top
R44  18.41,15.24 0 bottom
R45  29.84,19.05 0 top
R46  29.84,15.24 0 top
R47  29.84,20.95 0 top
R48  76.83,3.81 90 top
R49  43.18,85.09 180 top
R50  49.53,80.01 90 top
R51  46.99,85.09 0 top
R52  46.99,80.01 90 top
R55  80.01,69.85 270 top
R56  77.47,69.85 270 top
R57  74.93,69.85 270 top
R73  73.66,80.64 90 top
R75  82.55,78.74 90 top
R76  50.55,36.2 270 top
R77  48.51,36.2 270 top
R78  42.55,36.2 270 top
R79  46.35,48.9 90 top
R81  46.48,36.2 270 top
R82  44.45,36.2 270 top
R84  6.35,78.74 180 top
R85  6.35,86.36 180 top
R86  6.35,81.28 180 top
R90  16.51,74.93 90 top
R91  19.05,74.93 90 top
R92  21.59,74.93 90 top
R93  31.75,74.93 90 top
R94  34.29,74.93 90 top
R95  36.83,74.93 90 top
R98  90.17,24.13 180 top
R99  90.17,26.67 180 top
R100  95.25,39.37 0 top
R101  95.25,33.02 0 top
R102  71.12,3.81 90 top
R103  80.9,3.81 270 top
R104  90.17,5.71 180 top
R105  83.19,5.71 180 top
R106  78.74,3.81 90 top
R107  68.58,7.62 0 top
R108  68.58,5.71 0 top
R109  68.58,9.53 0 top
R110  81.28,19.05 90 top
R111  68.58,16.51 180 top
R112  73.66,20.95 90 top
R113  68.58,18.41 180 top
R114  68.58,20.32 180 top
R115  71.75,20.95 90 top
R116  74.93,27.3 90 top
R117  83.82,27.3 90 top
R118  82.55,64.77 270 top
R119  81.28,62.23 0 top
R120  85.09,64.77 270 top
R128  49.53,90.17 180 bottom
R130  74.93,90.17 180 bottom
S2  93.34,36.2 180 top
S3  93.34,29.84 180 top
STANDOFF1  5,95 0 top
STANDOFF2  95.17,60.24 0 top
STANDOFF3  5,73.58 0 top
STANDOFF4  95,95 0 top
U1  50,25.4 90 top
U2  28.57,16.51 90 bottom
U3  46.99,42.55 180 top
U4  67.31,80.01 180 top
U5  44.45,81.28 270 top
U6  80.01,78.74 0 top
U7  34.29,81.28 180 top
U8  19.05,81.28 180 top
U9  86.36,60.96 90 top
U10  76.2,10.16 0 top
U11  73.66,33.66 180 top
U12  82.55,33.66 180 top
U$1  16.51,77.47 90 bottom
Y1  64.77,69.85 0 top
Y2  55.24,45.72 270 top

### Tracks (layer width: path | path; a pad name or v marks a point on that pad's centre or on a via)
3.3V  (via drill 0.6)
  Top 0.203: v41.91,83.19 41.91,84.67 R49.2 | v46.35,51.44 R79.2
  Top 0.254: v13.97,79.38 14.82,80.22 C24.2 C23.2 17.09,83.82 U8.4 | v29.84,79.38 30.06,79.59 C27.2 C26.2 32.33,83.82 U7.4 | C12.2 61.38,76.62 62.23,77.47 63.5,77.47 63.73,77.23 U4.16 | v42.55,33.66 R78.2 | 49.53,34.33 R76.2 | v49.53,33.66 49.53,34.33 | 49.53,34.33 R77.2 | U3.8 48.97,40.01 v50.16,40.01 50.8,40.64 C21.2 | v97.79,39.37 R100.2 | v97.79,33.02 R101.2
  Top 0.406: v43.18,77.47 C10.1 44.45,77.89 U5.5 | v49.53,82.55 R50.2 | 58.2,76.83 C14.2 C12.2 | C22.1 8.26,83.82 v8.89,83.19
  Bottom 0.406: U$1.4 11.41,83.17 11.43,83.19 | 49.53,53.98 73.66,53.98 87,40.64 87,29.84
  other vias: 81.28,28.57 81.28,27.3 80.01,27.3 78.74,27.3 59.69,75.18 58.42,75.18 57.15,75.18 12.7,79.38 28.57,79.38
  pour Top: 77.47,24.77 77.47,28.57 80.01,28.57 80.01,31.11 82.55,31.11 82.55,27.3 83.82,27.3 83.82,24.77
  pour Bottom (isolate 0.254): 77.47,29.84 77.47,26.04 82.55,26.04 82.55,29.84
  pour Bottom (isolate 0.254): 97.16,40.01 98.42,40.01 98.42,31.11 89.53,31.11 84.45,26.04 82.55,26.04 82.55,29.84 87,29.84 89.53,32.38 97.16,32.38
  pour Bottom (isolate 0.254): 12.19,82.55 12.19,78.74 14.61,78.74 14.61,82.55
  pour Bottom (isolate 0.254): 27.94,82.55 27.94,78.74 30.48,78.74 30.48,82.55
  pour Bottom (isolate 0.254): 10.79,83.82 10.79,81.92 57.15,81.92 57.15,83.82
  pour Bottom (isolate 0.254): 41.27,82.55 41.27,54.61 43.81,54.61 43.81,82.55
  pour Bottom (isolate 0.254): 57.15,82.55 57.15,74.55 55.37,74.55 55.37,82.55
  pour Bottom (isolate 0.254): 10.79,83.82 6.99,83.82 6.99,82.55 10.79,82.55
  pour Bottom (isolate 0.254): 45.72,54.61 45.72,50.8 49.53,50.8 49.53,34.29 41.91,34.29 41.91,33.02 50.8,33.02 50.8,54.61
  pour Bottom (isolate 0.254): 15.88,14.61 18.41,14.61 18.41,16.51 20.95,16.51 20.95,21.59 22.86,21.59 22.86,22.23 18.41,22.23 18.41,19.05 15.88,19.05
  pour Bottom (isolate 0.254): 45.72,50.8 42.55,53.34 29.84,53.34 31.11,54.61 46.99,54.61 46.99,50.8
  pour Bottom (isolate 0.254): 19.05,21.59 20.95,21.59 20.95,30.48 32.38,41.91 32.38,53.34 29.84,53.34 29.84,41.91 19.05,31.11
  pour Bottom (isolate 0.254): 50.8,54.61 74.93,54.61 89.53,40.01 89.53,32.38 87,29.84 85.09,29.84 85.09,41.27 73.66,52.7 50.8,52.7
  pour Top (isolate 0.254): 56.52,74.3 61.59,74.3 62.87,75.56 62.87,77.47 64.14,77.47 64.14,78.11 60.96,78.11 60.33,77.47 57.78,77.47 56.52,76.2
  pour Top (isolate 0.254): 27.94,78.74 30.48,78.74 33.02,81.28 33.02,84.45 29.21,84.45 29.21,80.01 27.94,80.01
  pour Top (isolate 0.254): 12.06,80.01 12.06,78.74 15.24,78.74 17.78,81.28 17.78,84.45 13.97,84.45 13.97,80.01
  pour Bottom (isolate 0.254): 41.27,59.05 38.73,59.05 38.73,54.61 41.27,54.61
  pour Bottom (isolate 0.254): 55.63,76.83 55.63,74.55 60.2,74.55 61.47,75.69 61.47,76.83
5V  (via drill 0.6)
  Top 0.203: U9.9 83.32,60.46 83.19,60.33
  Top 0.254: U4.1 72.24,83.67 72.39,83.82 | U6.4 82.1,80.04 | 82.1,80.04 R75.2 82.77,79.38 v84.45,79.38 | C15.1 C18.1 82.1,80.88 82.1,80.04
  other vias: 72.39,28.57 72.39,27.3 71.12,27.3 69.85,27.3 83.82,57.78 83.82,56.52 83.82,55.24 69.22,40.64 70.48,40.64 70.48,39.37 69.22,39.37 82.55,55.24 77.47,85.09 77.47,83.82 77.47,82.55 84.45,78.11 84.45,76.83
  pour Top: 71.12,31.11 72.39,31.11 73.66,29.84 73.66,27.3 74.93,27.3 74.93,24.77 68.58,24.77 68.58,28.57 71.12,28.57
  pour Bottom (isolate 0.254): 72.39,87 72.39,81.28 80.01,81.28 83.19,84.45 83.19,87
  pour Bottom (isolate 0.305): 81.92,54.61 85.72,54.61 85.72,85.09 83.19,87 80.01,87 80.01,81.28 83.82,77.47 83.82,59.05 81.92,57.15
  pour Bottom (isolate 0.254): 68.58,29.84 68.58,26.04 73.66,26.04 73.66,29.84
  pour Bottom (isolate 0.254): 68.58,41.27 71.12,41.27 71.12,29.84 72.39,29.84 73.66,28.57 73.66,26.04 68.58,26.04
  pour Top (isolate 0.254): 68.58,41.27 71.12,41.27 85.09,55.24 85.09,60.96 81.92,60.96 81.92,54.61
  pour Top (isolate 0.254): 68.58,41.27 68.58,38.73 71.12,38.73 71.12,41.27
  pour Top (isolate 0.254): 71.75,83.19 76.83,83.19 76.83,81.92 78.11,81.92 78.11,85.72 71.75,85.72
  pour Top (isolate 0.254): 83.82,76.2 85.09,76.2 85.09,80.01 82.55,80.01 82.55,84.45 81.28,84.45 81.28,81.28 80.64,80.64 80.64,78.74 83.82,78.74
  pour Bottom (isolate 0.254): 83.82,76.2 81.28,76.2 81.28,72.39 83.82,72.39
AFE_!DRDY  (via drill 0.6)
  Top 0.203: U4.21 66.98,73.86 68.2,72.64 72.26,72.64 73.79,71.12 73.79,67.56 v74.3,67.06 74.04,67.31 | R15.1 67.56,43.18 73.79,49.4 v73.79,55.63
  Bottom 0.203: v73.79,55.63 73.79,66.55 v74.3,67.06
AFE_!PWDN  (via drill 0.6)
  Top 0.203: U4.14 60.81,83.67 55.24,78.11 v55.24,72.39 | R18.1 65.91,50.8 66.29,51.18 66.29,54.99 v65.66,55.63
  Bottom 0.203: v55.24,72.39 55.24,66.04 v65.66,55.63
AFE_!RESET  (via drill 0.6)
  Top 0.203: U4.15 63.09,74.9 61.85,73.66 57.78,73.66 v56.52,72.39 | v67.06,55.63 66.8,55.37 66.8,49.02 66.04,48.26 R17.1
  Bottom 0.203: v56.52,72.39 55.75,71.63 55.75,66.29 65.41,56.64 66.04,56.64 v67.06,55.63
AFE_AIN0
  Top 0.203: J6.1 J8.S 81.28,88.52 79.5,86.74 75.82,86.74 74.3,88.27 74.3,92.96 72.77,94.49 72.05,94.49 R6.1
AFE_AIN1
  Top 0.203: R7.1 69.85,93.98 70.87,95 72.9,95 74.8,93.09 74.8,88.39 75.95,87.25 78.23,87.25 78.74,87.76 J8.GND
  Bottom 0.203: R130.2 J8.GND
AFE_AIN2
  Top 0.203: J7.1 J9.S 55.88,88.27 56.64,87.5 60.83,87.5 61.59,88.27 61.59,92.33 62.36,93.09 65.87,93.09 R8.1
AFE_AIN3
  Top 0.203: J9.GND 53.34,87.63 53.98,87 60.96,87 62.1,88.14 62.1,91.82 62.74,92.46 64.14,92.46 64.77,91.82 R9.1
  Bottom 0.203: R128.2 J9.GND
AIN0+
  Top 0.406: U8.3 18.41,86.14 C25.1 18.2,88.48 J4.2
AIN0-
  Top 0.406: U8.2 19.68,86.14 C25.2 19.9,88.48 J4.1
AIN1+
  Top 0.406: U7.3 33.66,86.14 C28.1 33.44,88.48 J5.2
AIN1-
  Top 0.406: U7.2 34.92,86.14 C28.2 35.14,88.48 J5.1
BT_CONN  (via drill 0.6)
  Top 0.203: R45.2 31.88,19.05 | v32.13,18.16 32.13,18.8 31.88,19.05 | R23.2 34.67,38.1 31.88,35.31 31.88,19.05
  Bottom 0.203: U2.19 34.38,15.91 v32.13,18.16
BT_RESET  (via drill 0.6)
  Top 0.203: v27.05,10.67 27.43,10.29 31.62,10.29 35.43,14.1 35.43,23.75 33.91,25.27 33.91,27.18 34.67,27.94 R19.2
  Bottom 0.203: U2.5 23.01,14.71 v27.05,10.67
  Bottom 0.254: R44.1 20.32,15.24 20.95,14.61 21.87,14.61 U2.5
BT_RXTX  (via drill 0.6)
  Top 0.203: R24.2 33.27,40.64 30.48,37.85 v30.48,27.94 | v30.48,24.13 30.48,21.17 R47.2
  Bottom 0.203: v30.48,24.13 U2.31 v30.48,27.94
BT_STATE  (via drill 0.6)
  Top 0.203: R46.2 31.88,15.24 32.13,14.99 v32.13,14.35 34.92,17.14 34.92,23.62 33.4,25.15 33.4,29.34 34.54,30.48 R20.2
  Bottom 0.203: U2.21 32.97,13.51 v32.13,14.35
CS_AFE  (via drill 0.6)
  Top 0.203: U4.20 66.33,73.75 67.94,72.14 72.01,72.14 73.28,70.87 73.28,67.56 v72.77,67.06 | R16.1 69.34,45.72 73.28,49.66 73.28,54.86 v72.52,55.63
  Bottom 0.203: v72.77,67.06 73.28,66.55 73.28,56.39 v72.52,55.63
CS_DAC  (via drill 0.6)
  Top 0.203: R5.1 64.98,21.25 64.64,21.59 60.96,21.59 60.2,22.35 60.2,54.99 v60.83,55.63 | v59.31,60.07 76.58,60.07 78.49,61.98 v78.49,62.74 | v82.55,67.69 84.45,67.69 85.09,67.06 R120.1
  Bottom 0.203: v60.83,55.63 61.98,56.77 61.98,58.04 59.94,60.07 v59.31,60.07 | v78.49,62.74 78.49,63.63 v82.55,67.69
CS_SD  (via drill 0.6)
  Top 0.203: R25.2 34.67,43.18 32.38,45.47 32.38,69.34 31.11,70.61 12.7,70.61 10.79,72.52 v10.79,73.41 | v10.79,79.38 10.79,84.71 v10.16,85.34
  Bottom 0.203: v10.79,73.41 v10.79,79.38 | v10.16,85.34 6.3,85.34 U$1.2
CS_TC0  (via drill 0.6)
  Top 0.203: R27.2 34.67,48.26 33.4,49.53 33.4,69.85 31.62,71.63 22.73,71.63 v21.59,72.77 | v19.05,72.9 R91.1
  Bottom 0.203: v21.59,72.77 19.18,72.77 v19.05,72.9
CS_TC1  (via drill 0.6)
  Top 0.203: R28.2 34.67,50.8 33.91,51.56 33.91,70.74 v34.29,71.12 | v34.29,72.9 R94.1
  Bottom 0.203: v34.29,71.12 v34.29,72.9
DAC0
  Top 0.254: U9.1 89.27,59.96 90.17,59.05 90.17,53.98 87.63,51.44 87.63,48.9 88.27,48.26 J10.S
DAC1
  Top 0.254: U9.2 89.03,60.46 90.17,61.59 J11.S
DAC_!CLR  (via drill 0.6)
  Top 0.203: R14.1 66.17,40.64 78.87,53.34 78.87,54.48 v79.38,54.99 | v87,63.63 88.41,62.21 U9.5
  Bottom 0.203: v79.38,54.99 81.03,53.98 87.63,53.98 88.39,54.74 88.39,62.23 v87,63.63
DAC_!LDAC  (via drill 0.6)
  Top 0.203: R13.1 66.04,38.1 67.94,40.01 67.94,41.66 79.38,53.09 v80.01,53.47 | v88.9,63.63 89.41,63.12 89.41,61.59 89.27,61.46 U9.4
  Bottom 0.203: v80.01,53.47 87.88,53.47 88.9,54.48 v88.9,63.63
GND  (via drill 0.6)
  Top 0.203: 75.2,6.87 75.18,6.86 | 75.2,9.16 v75.56,9.53 | 77.22,9.14 v76.83,9.53 U10.P$29
  Top 0.254: U4.2 U4.3 | U9.3 v87,60.96 | 75.2,6.87 U10.P$9 75.2,9.16 | U10.P$13 77.2,9.16 v76.83,9.53 | 75.18,6.86 75.18,6.6 74.93,6.35
  Top 0.406: C32.1 C9.1 | C13.1 C11.1
  other vias: 92.71,87.63 93.98,87.63 96.52,86.36 96.52,87.63 95.25,87.63 95.25,86.36 93.98,86.36 92.71,86.36 8.89,90.81 10.16,89.53 10.16,90.81 8.89,89.53 11.43,90.81 12.7,90.81 12.7,89.53 11.43,89.53 59.69,3.17 58.42,3.17 75.56,10.79 76.83,10.79 17.78,26.04 17.78,24.77 17.78,23.5 87,62.23 87,59.69 73.03,40.64 73.03,39.37 81.92,40.64 81.92,39.37 74.3,23.5 83.19,23.5 95.25,5.71 96.52,5.71 97.79,5.71 97.79,6.99 95.25,12.06 96.52,12.06 97.79,12.06 97.79,10.79 58.42,1.91 59.69,1.91 71.12,1.52 73.03,1.52 74.93,1.52 76.83,1.52 78.74,1.52 82.55,20.95 84.45,20.95 52.7,13.34 53.98,13.34 55.24,13.34 55.24,12.06 53.98,12.06 52.7,12.06 78.11,57.15 78.11,55.88 85.09,24.13 67.94,23.5
  pour Top (isolate 0.254, rank 6): -3.68,104.14 105.79,104.14 105.79,-1.78 -3.68,-1.78
  pour Bottom (isolate 0.254, rank 6): -4.7,106.05 107.82,106.05 107.82,-3.68 -4.7,-3.68
LED0  (via drill 0.6)
  Top 0.203: v79.12,41.78 79.88,42.55 84.84,42.55 87.63,39.75 87.63,25.82 R98.2
  Bottom 0.203: U1.11 61.47,27.94 65.02,31.5 65.02,39.88 67.69,42.55 78.36,42.55 v79.12,41.78
LED1  (via drill 0.6)
  Top 0.203: v79.12,43.05 85.09,43.05 88.14,40.01 88.14,27.85 R99.2
  Bottom 0.203: U1.12 61.47,30.48 64.52,33.53 64.52,40.13 67.44,43.05 v79.12,43.05
MICRO_!RESET
  Top 0.203: R1.1 64.98,1.69 66.04,0.64 86.36,0.64 88.9,3.17 97.79,3.17 99.06,4.45 99.06,33.66 98.42,34.29 93.98,34.29 92.08,36.2
  Top 0.254: R100.1 C29.1 92.29,36.41 92.08,36.2 S2.P$2
MISO  (via drill 0.6)
  Top 0.203: R57.2 74.93,68.96 75.95,67.94 77.6,67.94 79.5,66.04 79.5,62.1 75.06,57.66 61.72,57.66 60.83,58.55 v59.31,58.55 | v57.66,21.46 58.42,22.23 58.42,54.36 v56.77,56.01 56.77,56.77 40.39,73.15 39.88,73.15 38.95,74.08 R95.1 34.89,72.14 31.75,72.14 29.81,74.08 R92.1 19.52,72.01 13.97,72.01 7.24,78.74 R84.1
  Bottom 0.203: v57.66,21.46 57.66,20.95 60.33,18.29 60.33,16.34 U1.6 | v56.77,56.01 56.77,56.77 58.55,58.55 v59.31,58.55
MOSI  (via drill 0.6)
  Top 0.203: R56.2 77.47,68.96 80.39,66.04 80.39,62.27 R119.1 80.26,62.23 75.18,57.15 60.96,57.15 v60.33,57.78 | v58.42,18.8 58.67,19.05 58.67,21.72 59.05,22.1 59.05,55.63 v57.91,56.77 57.53,57.15 57.15,57.15 v40.13,74.17 | R85.1 7.24,86.36 9.91,83.69 9.91,81.41 8.89,80.39 8.89,78.74 13.34,74.3 v14.61,74.3
  Bottom 0.203: v58.42,18.8 59.82,17.4 59.82,14.31 U1.5 | v14.61,74.3 40.01,74.3 v40.13,74.17 | v60.33,57.78 58.93,57.78 v57.91,56.77
N$1
  Top 0.203: U1.4 R1.2
N$2
  Top 0.203: J2.D- 49.2,10.28 R3.2
N$3
  Top 0.203: J2.D+ 50,10.41 R2.2
N$4
  Top 0.406: J2.VBUS 48.4,9.26 47.88,9.78 46.1,9.78 45.72,10.16 R4.2
N$5
  Top 0.203: U1.8 R5.2
N$7
  Top 0.203: U4.7 67.64,86.05 68.62,87.03 69.22,87.03 C3.1 69.85,87.03 R7.2
N$8
  Top 0.61: R11.2 C2.2 C1.2 59.05,5.08
  Top 0.813: C1.2 U1.2
N$9
  Top 0.203: U4.6 68.28,85.05 69.09,85.85 70.48,85.85 71.12,86.49 71.12,87.16 C3.2 72.39,87.8 C52.1 72.35,88.69 71.12,89.92 R6.2
N$10
  Top 0.203: U4.8 66.98,86.65 C36.2 66.67,87.03 66.67,88.69 C54.1 66.67,89.11 R8.2
N$11
  Top 0.203: U4.9 66.33,85.6 C36.1 64.77,87.16 R9.2
N$12  (via drill 0.6)
  Top 0.203: v54.61,35.56 52.92,35.56 R12.2
  Bottom 0.203: U1.14 v54.61,35.56
N$13
  Top 0.203: U1.30 R19.1
N$14
  Top 0.203: U1.15 R13.2
N$15
  Top 0.203: U1.29 R20.1
N$16
  Top 0.203: 36.2,33.02 R21.1 U1.28
N$17
  Top 0.203: U1.27 R22.1
N$18
  Top 0.203: U1.26 R23.1
N$19
  Top 0.203: U1.25 R24.1
N$20
  Top 0.203: U1.16 R14.2
N$21
  Top 0.203: U1.17 R15.2
N$22
  Top 0.203: U1.18 R16.2
N$23
  Top 0.203: U1.19 R17.2
N$24
  Top 0.203: U1.20 R18.2
N$25
  Top 0.203: U1.24 R25.1
N$26
  Top 0.203: U1.23 R26.1
N$27
  Top 0.203: U1.22 R27.1
N$28
  Top 0.203: U1.21 R28.1
N$33  (via drill 0.6)
  Top 0.203: v19.43,13.21 20.61,13.21 R34.2
  Bottom 0.203: U2.4 19.73,13.51 v19.43,13.21
N$34  (via drill 0.6)
  Top 0.203: R33.2 v19.43,11.43
  Bottom 0.203: v19.43,11.43 20.31,12.31 U2.3
N$39  (via drill 0.6)
  Top 0.203: R39.2 32,17.14 32.13,17.02 v32.13,16.26
  Bottom 0.203: U2.20 33.68,14.71 v32.13,16.26
N$44
  Top 0.203: R45.1 28.82,19.05 D1.A
N$45
  Top 0.203: R46.1 D2.A
N$46
  Top 0.203: R47.1 28.82,20.95 D3.A
N$47
  Top 0.203: R49.1 R51.1 45.45,84.4 U5.1
N$48
  Top 0.406: U5.6 45.67,79.16 R52.1 R50.1
N$51
  Top 0.203: U4.24 68.94,74.58 69.34,74.17 76.54,74.17 R55.1
N$52
  Top 0.203: U4.23 68.28,74.08 68.71,73.66 74.51,73.66 R56.1
N$53
  Top 0.203: U4.22 67.64,73.97 68.45,73.15 72.48,73.15 R57.1
N$69
  Top 0.254: U4.4 69.58,82.18 69.85,81.92 73.24,81.92 R73.2
N$71
  Top 0.254: U6.3 82.1,77.44 R75.1
N$72
  Top 0.203: U4.18 65.03,72.02 63.63,70.61 60.71,70.61 Y1.1 59.94,66.84 C20.1
N$73
  Top 0.203: U4.19 65.69,71.98 67.82,69.85 Y1.2 69.6,66.84 C19.1
N$74
  Top 0.203: Y2.1 55.24,48.9 53.98,47.62 48.26,47.62 47.62,46.99 U3.2
N$75
  Top 0.203: Y2.2 55.24,42.55 50.8,46.99 49.53,46.99 48.9,46.35 U3.1
N$77
  Top 0.203: U3.6 46.35,37.17 R81.1 R77.1
N$78
  Top 0.203: U3.5 45.09,37.68 R82.1 R78.1
N$81  (via drill 0.6)
  Top 0.254: R86.2 4.7,81.28 v3.94,82.04
  Bottom 0.254: v3.94,82.04 5.84,82.04 U$1.5
N$82  (via drill 0.6)
  Top 0.254: R85.2 4.57,86.36 v4.06,85.85
  Bottom 0.254: v4.06,85.85 4.06,84.84 4.57,84.33 5.81,84.33 U$1.3
N$83  (via drill 0.6)
  Top 0.254: R84.2 5.08,78.74 v3.94,79.88
  Bottom 0.254: v3.94,79.88 5.86,79.88 U$1.7
N$86
  Top 0.203: U8.7 19.68,76.83 20.32,76.2 21.17,76.2 R92.2
N$87
  Top 0.203: U8.6 18.41,76.42 R91.2
N$88
  Top 0.203: U8.5 17.14,76.42 R90.2
N$89
  Top 0.203: U7.7 34.92,76.83 35.56,76.2 36.41,76.2 R95.2
N$90
  Top 0.203: U7.6 33.66,76.42 R94.2
N$91
  Top 0.203: U7.5 32.38,76.42 R93.2
N$92
  Top 0.254: LED3.P$2 91.86,24.98 R98.1
N$93
  Top 0.254: LED3.P$1 91.86,25.82 R99.1
N$97
  Top 0.203: R103.1 86.58,4.66 87.63,5.71 R104.2
  Top 0.254: U10.P$14 77.7,6.5 78.61,5.59 79.97,5.59 R103.1
N$98  (via drill 0.6)
  Top 0.203: U10.P$16 79.36,9.16 v81.15,7.37 | R103.2 82.46,2.96 v82.55,3.05
  Bottom 0.203: v81.15,7.37 81.15,4.45 v82.55,3.05
N$99
  Top 0.254: U10.P$15 78.6,6.36 78.87,6.1 81.95,6.1 R105.2
N$100
  Top 0.254: U10.P$12 76.7,6.7 R106.2
N$101
  Top 0.203: U10.P$5 70.8,9.66 70.48,9.34 70.48,8.68 R107.2
N$102
  Top 0.203: U10.P$6 71.44,9.16 71.12,8.84 71.12,8.26 70.48,7.62 70.48,6.77 R108.2
N$103
  Top 0.203: U10.P$4 70.06,10.16 R109.2
N$104
  Top 0.254: U10.P$11 76.2,5.29 R48.2
N$105
  Top 0.203: U10.P$7 72.8,8.66 71.12,6.99 R102.2
N$106
  Top 0.203: U10.P$8 73.8,7.76 73.03,6.99 C38.1
N$107
  Top 0.254: U10.P$10 75.7,5.43 C37.1
N$109
  Top 0.203: U10.P$22 77.7,16.11 78.99,17.4 80.48,17.4 R110.1
N$110
  Top 0.203: U10.P$1 73.8,14.97 72.26,16.51 R111.1
N$111
  Top 0.203: U10.P$25 76.2,15.37 73.66,17.91 R112.1
N$112
  Top 0.203: U10.P$28 74.7,14.84 71.12,18.41 R113.1
N$113
  Top 0.203: U10.P$27 75.2,14.97 70.23,19.94 69.81,19.94 R114.1
N$114
  Top 0.203: R115.1 71.75,19.05 75.7,15.11 U10.P$26
N$115
  Top 0.254: U11.1 75.56,38.52 C40.1
N$116
  Top 0.254: U12.1 84.45,38.52 C39.1
N$117
  Top 0.254: U11.7 74.3,28.79 R116.2
N$118
  Top 0.254: U12.7 83.19,28.79 R117.2
N$119
  Top 0.203: U9.7 83.57,61.46 83.06,61.98 83.06,63.41 R118.2
N$120
  Top 0.203: U9.8 82.68,60.96 82.13,61.51 R119.2
N$121
  Top 0.203: U9.6 84.31,63.14 R120.2
N$124
  Top 0.254: U9.10 84.31,59.62 C50.1
RTC_!INTA
  Top 0.203: U3.3 R79.1
RTC_SQW
  Top 0.203: U3.7 47.62,38.1 49.49,38.1 R76.1 R12.1
SCK  (via drill 0.6)
  Top 0.152: 82.55,65.41 81.28,64.14 81.28,61.09 81.03,60.83 | 16.51,74.17 17.27,74.93 30.9,74.93 R93.1 | 31.75,74.17 32.51,74.93 40.51,74.93 41.15,74.3
  Top 0.203: R55.2 80.01,68.16 R118.1 82.55,65.41 | 81.03,60.83 79.63,60.83 75.44,56.64 59.82,56.64 59.69,56.52 | 59.69,56.52 59.69,56.9 58.8,57.78 57.28,57.78 41.15,73.91 41.15,74.3 | 59.69,56.52 v59.69,21.59 | R86.1 7.24,81.28 8.26,80.26 8.26,78.49 13.84,72.9 15.33,72.9 R90.1 16.51,74.17 | R93.1 31.75,74.17
  Bottom 0.203: U1.7 61.43,17.82 59.69,19.56 v59.69,21.59
SCL  (via drill 0.6)
  Top 0.203: R81.2 v46.48,31.5 46.1,31.5 44.83,30.23 43.18,30.23 40.89,32.51 40.89,38.61 43.43,41.15 43.43,50.93 45.72,53.21 45.72,54.36 44.96,55.12 v44.96,56.13 | R52.2 46.99,81.41 49.02,83.44 49.91,83.44 50.67,82.68 50.67,67.56 v50.16,67.06
  Bottom 0.203: U1.10 61.43,25.36 60.45,24.38 52.32,24.38 46.48,30.23 v46.48,31.5 | v50.16,67.06 50.67,66.55 50.67,61.85 v44.96,56.13
SD_CD  (via drill 0.6)
  Top 0.203: R26.2 34.67,45.72 32.89,47.5 32.89,69.6 31.37,71.12 13.97,71.12 12.83,72.26 v12.19,72.26
  Bottom 0.203: v12.19,72.26 12.19,74.04 16.07,77.92 U$1.CD1
SDA  (via drill 0.6)
  Top 0.203: R82.2 v44.45,31.5 42.67,31.5 41.4,32.77 41.4,38.48 43.94,41.02 43.94,50.67 46.23,52.96 v46.23,56.13 | R51.2 48.9,85.09 51.18,82.8 51.18,67.56 v51.69,67.06
  Bottom 0.203: U1.9 61.34,22.86 60.33,23.88 52.07,23.88 v44.45,31.5 | v51.69,67.06 51.18,66.55 51.18,61.59 46.23,56.64 v46.23,56.13
SW2  (via drill 0.6)
  Top 0.203: v79.12,44.45 80.01,43.56 85.34,43.56 88.65,40.26 88.65,35.31 89.79,34.16 91.95,34.16 92.2,33.91 92.2,33.11 C30.1
  Top 0.254: R101.1 C30.1 92.29,30.06 92.08,29.84 S3.P$2
  Bottom 0.203: U1.13 61.47,33.02 64.01,35.56 64.01,40.39 67.18,43.56 78.23,43.56 v79.12,44.45
UART_RX  (via drill 0.6)
  Top 0.203: R22.2 32.77,35.56 32.38,35.18 32.38,24.26 v33.53,23.11
  Bottom 0.203: v33.53,23.11 U2.13
UART_TX  (via drill 0.6)
  Top 0.203: R21.2 33.53,33.02 32.89,32.38 32.89,24.89 34.42,23.37 34.42,22.73 v33.53,21.84
  Bottom 0.203: v33.53,21.84 35.11,21.84 U2.14
USB_N
  Top 0.203: U1.32 38.57,23.13 39.37,23.93 44.37,23.93 49.33,18.97 49.33,13.97 49.31,13.97 R3.1
USB_P
  Top 0.203: U1.31 38.57,25.13 39.37,24.33 44.53,24.33 49.73,19.13 49.73,13.97 49.74,13.97 R2.1
VBATT  (via drill 0.6)
  Top 0.254: 80.26,11.68 80.24,11.66 U10.P$21 U10.P$20
  other vias: 83.82,15.24 83.82,13.97
  pour Top (isolate 0.254): 78.74,11.43 78.74,15.24 79.38,15.88 84.45,15.88 84.45,13.34 82.42,13.34 80.52,11.43
  pour Top (isolate 0.254): 84.45,13.34 84.45,15.88 83.19,15.88 83.19,13.34
  pour Bottom (isolate 0.254): 83.19,15.75 83.19,13.34 84.45,13.34 84.45,15.75
  pour Bottom (isolate 0.254): 84.45,13.34 89.53,8.26 93.98,8.26 94.61,7.62 96.52,7.62 96.52,10.16 90.04,10.16 84.45,15.75
VIN  (via drill 0.6)
  Top 0.254: U10.P$3 72.65,10.66 72.52,10.79 72.52,11.18 72.53,11.16 U10.P$2
  other vias: 69.22,11.43 70.48,11.43 71.75,12.7 71.75,11.43
  pour Top: 67.94,10.67 67.94,13.97 71.12,13.97 73.41,11.68 73.41,10.67
  pour Bottom (isolate 0.254): 84.45,16.64 89.03,12.06 90.81,12.06 92.08,13.34 92.08,17.14 90.17,19.05 84.45,19.05
  pour Bottom (isolate 0.254): 84.58,16.38 82.42,16.38 78.74,12.7 74.3,12.7 72.39,10.79 68.45,10.79 68.45,11.94 68.58,12.06 71.25,12.06 71.25,13.34 75.06,17.14 78.61,17.14 80.77,19.05 84.58,19.05
VLDO
  Top 0.152: 85.72,8.98 85.72,20.95
  Top 0.203: U10.P$17 83.34,9.66 C6.2 85.72,8.98 | R111.2 R113.2 R114.2 69.22,21.8 R115.2 R112.2 73.66,21.97 73.91,22.23 83.44,22.23 | 85.72,20.95 84.45,22.23 83.44,22.23 | 83.44,22.23 83.44,20.26 83.12,19.94 81.28,19.94 R110.2
VREF_2V5
  pour Top (isolate 0.254): 73.03,78.74 79.38,78.74 80.01,79.38 80.01,80.64 73.03,80.64
VSYS  (via drill 0.6)
  Top 0.254: U10.P$23 U10.P$24 76.7,13.84 76.83,13.97 77.22,13.59 77.22,12.45 | 75.56,33.02 v74.93,33.66 | 84.45,33.02 v83.82,33.66
  Top 0.406: U11.8 75.56,33.02 | U12.8 84.45,33.02 | U11.4 71.75,34.29 v72.39,33.66 | U12.4 80.64,34.29 v81.28,33.66
  Bottom 1.016: JP1.2 77.47,33.66 v78.74,33.66
  other vias: 73.66,33.66 82.55,33.66 76.2,20.95 76.2,19.68 76.2,18.41 57.15,13.34 58.42,13.34 58.42,12.06 57.15,12.06
  pour Top (isolate 0.254): 67.94,34.92 84.45,34.92 84.45,32.38 67.94,32.38
  pour Bottom (isolate 0.254): 71.75,34.92 71.75,32.38 84.45,32.38 84.45,34.92
  pour Top: 77.22,12.7 77.22,16.38 78.23,17.4 78.23,21.72 75.18,21.72 75.18,17.14 76.71,15.62 76.71,12.7
  pour Bottom (isolate 0.254): 75.56,17.78 76.83,17.78 76.83,31.75 76.83,32.38 75.56,32.38
  pour Bottom (isolate 0.254): 56.52,13.97 56.52,11.43 59.05,11.43 59.05,13.97
  pour Bottom (isolate 0.254): 75.56,17.78 69.22,17.78 62.87,11.43 59.05,11.43 59.05,13.97 63.5,13.97 68.58,19.05 76.83,19.05 76.83,17.78
  pour Top (isolate 0.254): 56.52,13.97 56.52,8.89 58.42,8.89 58.42,13.97
  pour Top (isolate 0.254): 56.52,13.97 59.69,13.97 59.69,11.43 56.52,11.43
VUSB  (via drill 0.6)
  Top 0.254: U10.P$18 80.14,10.16 | U10.P$19 80.02,10.66 80.14,10.54
  Top 0.406: v41.91,5.71 42.8,6.6 42.8,11.18 44.54,12.91 R4.1
  Bottom 0.254: 38.73,5.08 43.18,5.08 46.35,1.91 53.98,1.91 59.69,7.62
  other vias: 83.19,12.06 83.19,10.79 81.92,10.79 40.64,5.71 41.91,4.45 40.64,4.45
  pour Top (isolate 0.254): 78.11,10.16 78.11,10.79 85.72,10.79 85.72,10.16
  pour Top (isolate 0.254): 80.64,10.79 82.55,12.7 85.72,12.7 85.72,10.16 80.64,10.16
  pour Bottom (isolate 0.254): 81.28,11.43 82.55,12.7 83.82,12.7 83.82,9.53 81.28,9.53
  pour Bottom (isolate 0.254): 36.32,3.81 41.27,3.81 42.55,5.08 42.55,6.35 36.32,6.35
  pour Bottom (isolate 0.254): 59.69,6.35 78.11,6.35 81.28,9.53 81.28,11.43 77.47,7.62 64.14,7.62 62.23,9.53 59.05,9.53
  pour Bottom (isolate 0.254): 41.27,6.35 43.18,6.35 46.35,3.17 52.7,3.17 59.05,9.53 62.23,9.53 64.14,7.62 64.14,6.35 59.69,6.35 53.34,0 45.09,0 41.27,3.81
  pour Top (isolate 0.254): 36.32,6.35 36.32,3.81 42.55,3.81 42.55,6.35